# Altium project OK335xD.PrjPcb
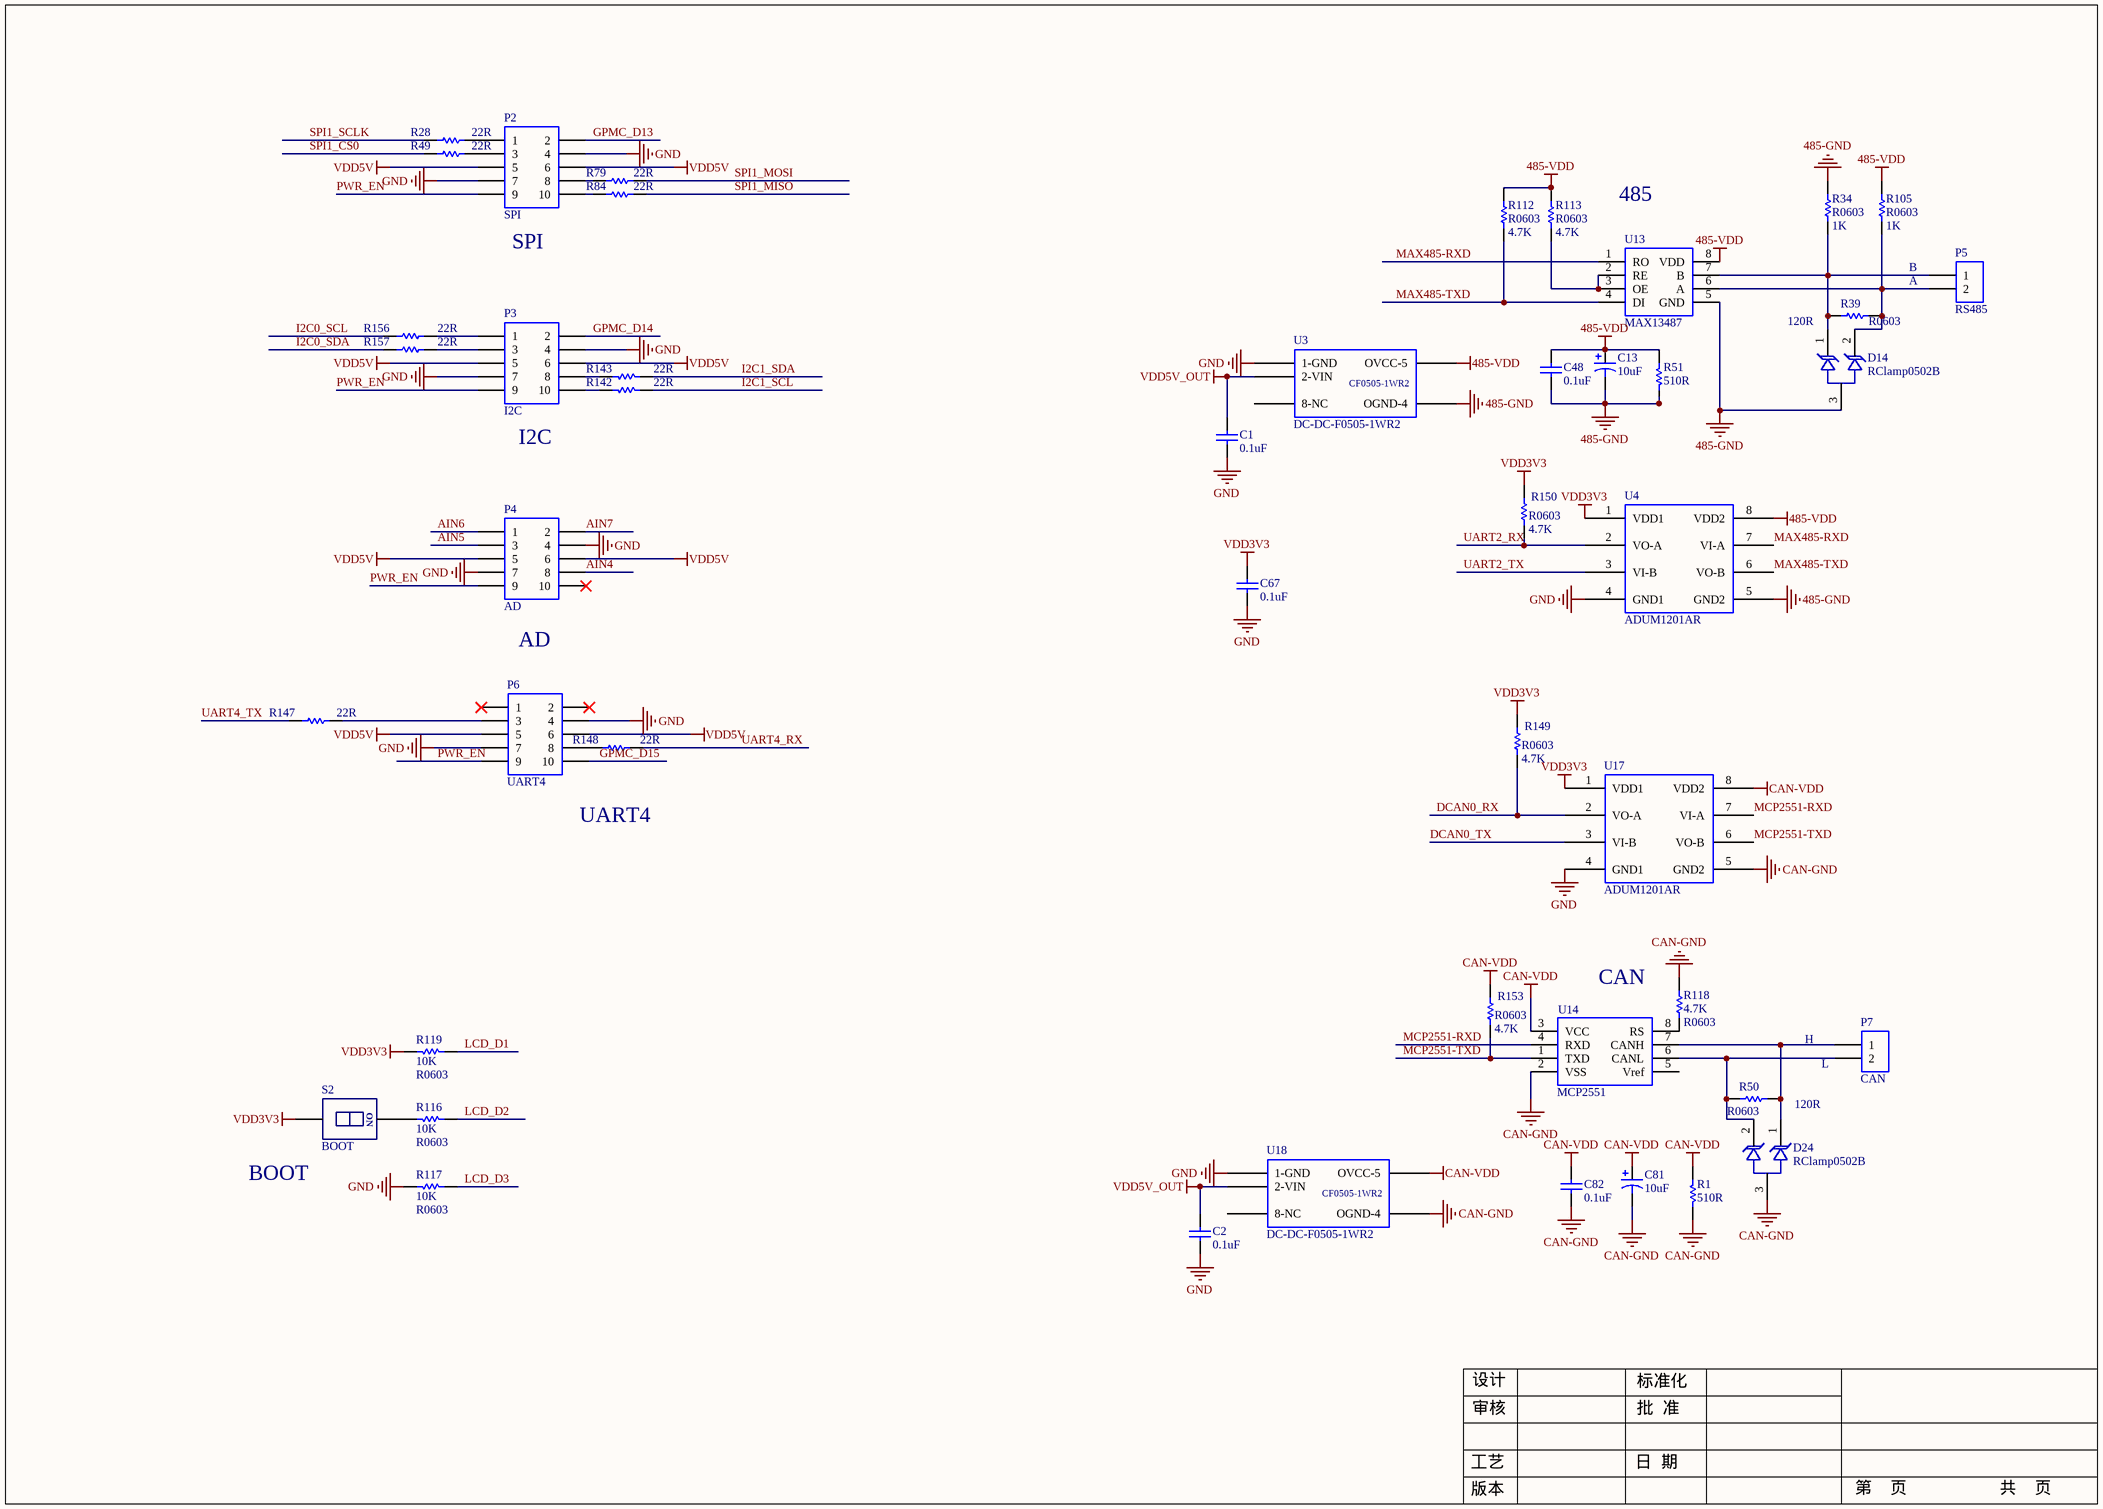
[diagram p0: AD & i2C & SPI.SchDoc]
8 sheets, 325 parts. Net scope: global (net labels, ports and power ports of the same name join across sheets).
Board file: OK335xD V2.4 20160121.PcbDoc
Sheets:
  AD & i2C & SPI.SchDoc
  Audio.SchDoc
  LCD.SchDoc
  NET & UART.SchDoc
  Power & SD.SchDoc
  SDIO_WIFI.SchDoc
  SODIMM.SchDoc
  USB.SchDoc

## Sheet AD & i2C & SPI.SchDoc
size 393 x 281 mm

### Parts
C1  value 0.1uF  [C0603_M1608]  (hidden comment: C0603)
C2  value 0.1uF  [C0603_M1608]  (hidden comment: C0603)
C13  value 10uF  [TC3216A]  (hidden comment: Cap Pol3)
C48  value 0.1uF  [C0603_M1608]  (hidden comment: C0603)
C67  value 0.1uF  [C0603_M1608]  (hidden comment: C0603)
C81  value 10uF  [TC3216A]  (hidden comment: Cap Pol3)
C82  value 0.1uF  [C0603_M1608]  (hidden comment: C0603)
D14  value RClamp0502B  [SOT-523]  (hidden comment: LCTVS)
D24  value RClamp0502B  [SOT-523]  (hidden comment: LCTVS)
P2  SPI  [IDC10S]
P3  I2C  [IDC10S]
P4  AD  [IDC10S]
P5  RS485  [2EDGKA-5.08-2P]
P6  UART4  [IDC10S]
P7  CAN  [2EDGKA-5.08-2P]
R1  value 510R  [1206]  (hidden comment: R1808)
R28  value 22R  [R0603_M1608]  (hidden comment: R0603)
R34  R0603  value 1K  [R0603_M1608]
R39  R0603  value 120R  [R0603_M1608]
R49  value 22R  [R0603_M1608]  (hidden comment: R0603)
R50  R0603  value 120R  [R0603_M1608]
R51  value 510R  [1206]  (hidden comment: R1808)
R79  value 22R  [R0603_M1608]  (hidden comment: R0603)
R84  value 22R  [R0603_M1608]  (hidden comment: R0603)
R105  R0603  value 1K  [R0603_M1608]
R112  R0603  value 4.7K  [R0603_M1608]
R113  R0603  value 4.7K  [R0603_M1608]
R116  10K  value R0603  [R0603_M1608]
R117  10K  value R0603  [R0603_M1608]
R118  4.7K  value R0603  [R0603_M1608]
R119  10K  value R0603  [R0603_M1608]
R142  value 22R  [R0603_M1608]  (hidden comment: R0603)
R143  value 22R  [R0603_M1608]  (hidden comment: R0603)
R147  value 22R  [R0603_M1608]  (hidden comment: R0603)
R148  value 22R  [R0603_M1608]  (hidden comment: R0603)
R149  R0603  value 4.7K  [R0603_M1608]
R150  R0603  value 4.7K  [R0603_M1608]
R153  R0603  value 4.7K  [R0603_M1608]
R156  value 22R  [R0603_M1608]  (hidden comment: R0603)
R157  value 22R  [R0603_M1608]  (hidden comment: R0603)
S2  BOOT  [SWITCH_1P]
U3  DC-DC-F0505-1WR2  [CF0505-1WR2]
U4  ADUM1201AR  [SO8_N - ADUM1201]
U13  MAX13487  [SOIC-8N]
U14  MCP2551  [SOIC-8N]
U17  ADUM1201AR  [SO8_N - ADUM1201]
U18  DC-DC-F0505-1WR2  [CF0505-1WR2]

### Nets
485-GND: C13.2 C48.1 D14.3 R34.1 R51.2 U3.4(OGND-4) U4.5(GND2) U13.5(GND)
485-VDD: C13.1 C48.2 R51.1 R105.1 R112.1 R113.1 U3.5(OVCC-5) U4.8(VDD2) U13.8(VDD)
CAN-GND: C81.2 C82.1 D24.3 R1.2 R118.1 U14.2(VSS) U17.5(GND2) U18.4(OGND-4)
CAN-VDD: C81.1 C82.2 R1.1 R153.1 U14.3(VCC) U17.8(VDD2) U18.5(OVCC-5)
GND: C1.1 C2.1 C67.1 P2.4 P2.7 P3.4 P3.7 P4.4 P4.7 P6.4 P6.7 R117.2 U3.1(1-GND) U4.4(GND1) U17.4(GND1) U18.1(1-GND)
VDD3V3: C67.2 R119.2 R149.1 R150.1 S2.1 U4.1(VDD1) U17.1(VDD1)
VDD5V: P2.5 P2.6 P3.5 P3.6 P4.5 P4.6 P6.5 P6.6
VDD5V_OUT: C1.2 C2.2 U3.2(2-VIN) U18.2(2-VIN)
AIN4: P4.8
AIN5: P4.3
AIN6: P4.1
AIN7: P4.2
DCAN0_RX: R149.2 U17.2(VO-A)
DCAN0_TX: U17.3(VI-B)
GPMC_D13: P2.2
GPMC_D14: P3.2
GPMC_D15: P6.10
I2C0_SCL: R156.2
I2C0_SDA: R157.2
I2C1_SCL: R142.1
I2C1_SDA: R143.1
LCD_D1: R119.1
LCD_D2: R116.1
LCD_D3: R117.1
MAX485-RXD: U4.7(VI-A) U13.1(RO)
MAX485-TXD: R112.2 U4.6(VO-B) U13.4(DI)
MCP2551-RXD: U14.4(RXD) U17.7(VI-A)
MCP2551-TXD: R153.2 U14.1(TXD) U17.6(VO-B)
PWR_EN: P2.9 P3.9 P4.9 P6.9
SPI1_CS0: R49.2
SPI1_MISO: R84.1
SPI1_MOSI: R79.1
SPI1_SCLK: R28.2
UART2_RX: R150.2 U4.2(VO-A)
UART2_TX: U4.3(VI-B)
UART4_RX: R148.2
UART4_TX: R147.1
NetD14_1: D14.1 P5.1 R34.2 R39.2 U13.7(B)
NetD14_2: D14.2 P5.2 R39.1 R105.2 U13.6(A)
NetD24_1: D24.1 P7.1 R50.1 U14.7(CANH)
NetD24_2: D24.2 P7.2 R50.2 U14.6(CANL)
NetP2_1: P2.1 R28.1
NetP2_3: P2.3 R49.1
NetP2_8: P2.8 R79.2
NetP2_10: P2.10 R84.2
NetP3_1: P3.1 R156.1
NetP3_3: P3.3 R157.1
NetP3_8: P3.8 R143.2
NetP3_10: P3.10 R142.2
NetP6_3: P6.3 R147.2
NetP6_8: P6.8 R148.1
NetR113_2: R113.2 U13.2(RE) U13.3(OE)
NetR116_2: R116.2 S2.2
NetR118_2: R118.2 U14.8(RS)

Not connected (* = marked no-connect by the designer): P4 10*; P6 1* 2*; U3 8(8-NC); U14 5(Vref); U18 8(8-NC)

### Notes on the sheet
- 485
- (near P2) SPI
- A
- B
- (near P3) I2C
- AD
- UART4
- CAN
- (near P7) H
- L
- (near S2) BOOT
- 设计
- 标准化
- 审核
- 批  准
- 版本
- 工艺
- 日  期
- 第    页
- 共    页
- (in symbol DC-DC-F0505-1WR2) CF0505-1WR2
- (in symbol SW DIP-1) ON

### Library data of the parts
C1 C2 C48 C67 C82 = Cap: Capacitor; Published: 8-Jun-2000; LatestRevisionDate: 17-Jul-2002; LatestRevisionNote: Re-released for DXP Platform.; PackageReference: RAD-0.3; Publisher: Altium Limited
C13 C81 = Cap Pol3: Polarized Capacitor (Surface Mount); Published: 8-Jun-2000; LatestRevisionDate: 29-May-2009; LatestRevisionNote: IPC-7351 Footprint Added.; PackageReference: C0805; Publisher: Altium Limited; PackageDescription: Chip Capacitor
P2-P4 P6 = Header 5X2: Header, 5-Pin, Dual row; LatestRevisionDate: 17-Jul-2002; LatestRevisionNote: Re-released for DXP Platform.; Publisher: Altium Limited
P5 P7 = Header 2: Header, 2-Pin; LatestRevisionDate: 17-Jul-2002; LatestRevisionNote: Re-released for DXP Platform.; Publisher: Altium Limited
R1 R28 R34 R39 R49-R51 R79 R84 R105 R112 R113 R142 R143 R147-R150 R153 R156 R157 = Res1: Resistor; Published: 8-Jun-2000; LatestRevisionDate: 17-Jul-2002; LatestRevisionNote: Re-released for DXP Platform.; PackageReference: AXIAL-0.3; Publisher: Altium Limited
R116-R119 = Res1: R0603; Published: 8-Jun-2000; LatestRevisionDate: 17-Jul-2002; LatestRevisionNote: Re-released for DXP Platform.; PackageReference: AXIAL-0.3; Publisher: Altium Limited; PackageDescription: Axial Device, Thru-Hole; 2 Leads; 0.3 in Pin Spacing
S2 = SW DIP-1
U4 U17 = ADuM1201
U13 = MAX485: SOIC8
U14 = MCP2551: SOIC8

## Sheet Audio.SchDoc
size 393 x 281 mm
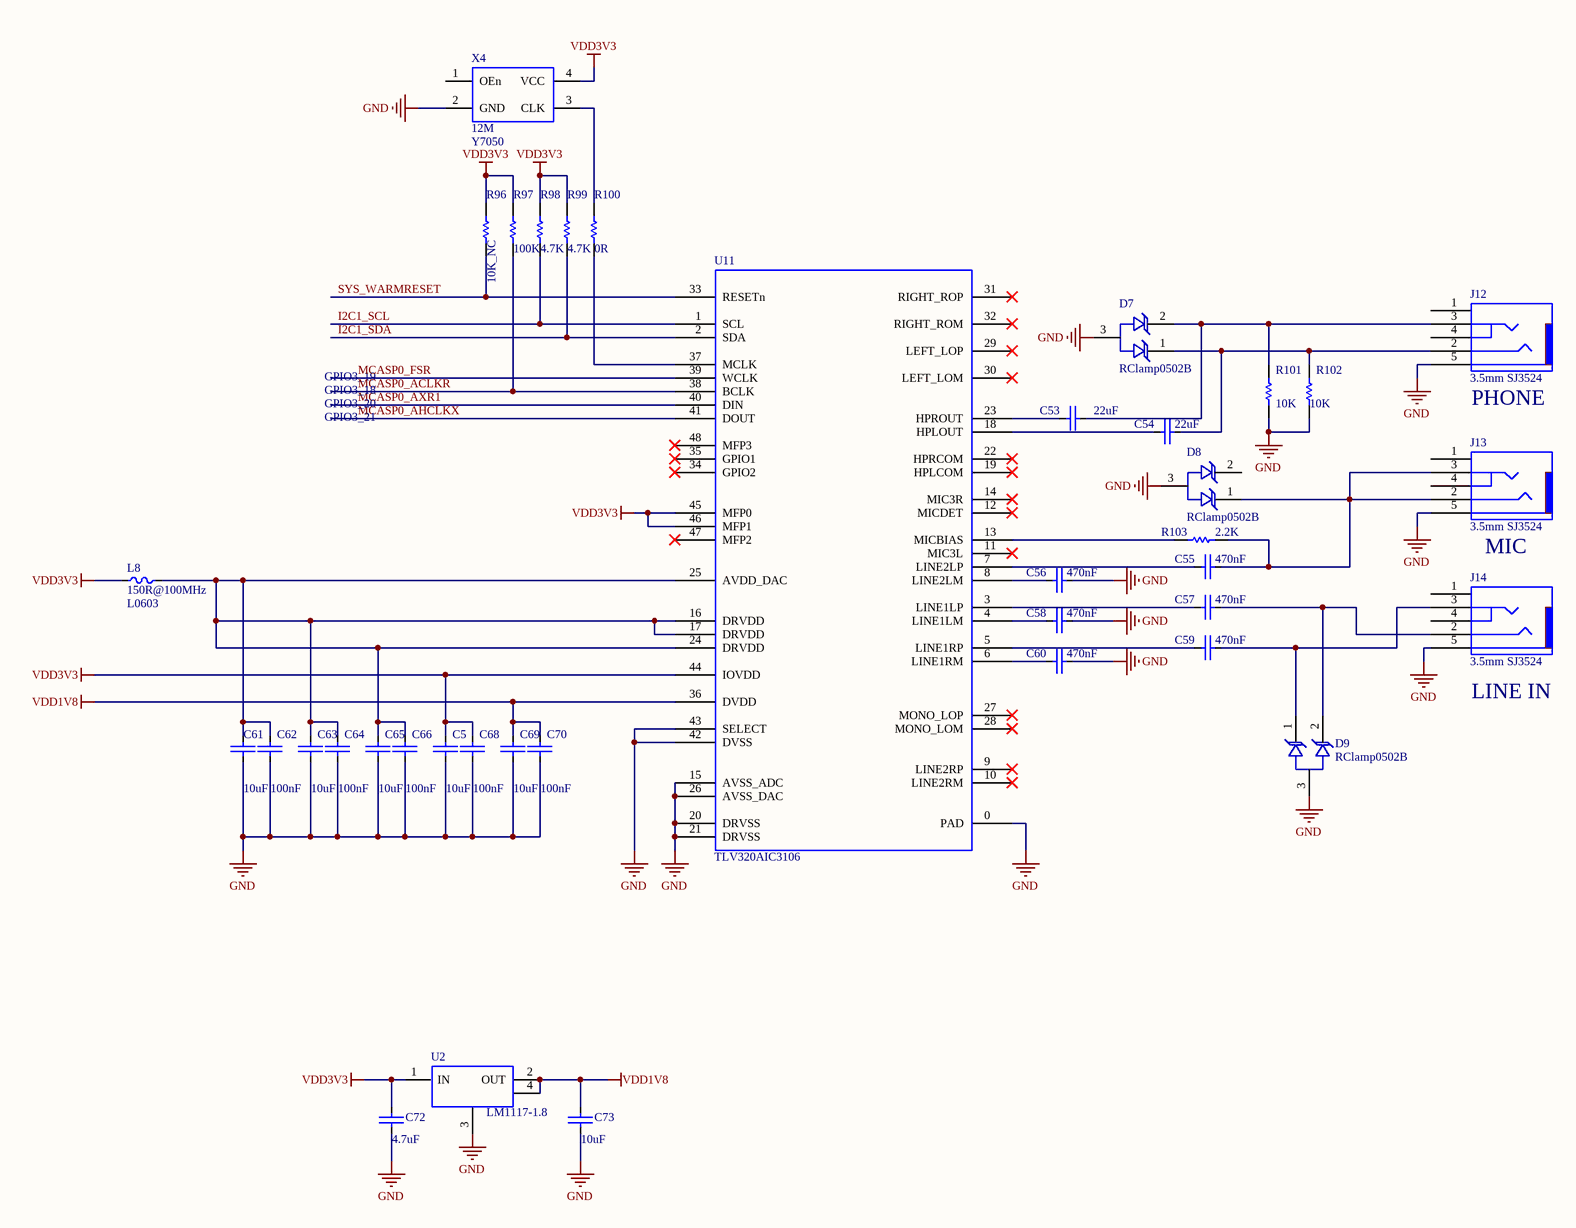
[diagram p1: Audio.SchDoc]

### Parts
C5  10uF  [C0603_M1608]
C53  22uF  [C1210_M3225]
C54  22uF  [C1210_M3225]
C55  470nF  [C0603_M1608]
C56  470nF  [C0603_M1608]
C57  470nF  [C0603_M1608]
C58  470nF  [C0603_M1608]
C59  470nF  [C0603_M1608]
C60  470nF  [C0603_M1608]
C61  10uF  [C0603_M1608]
C62  100nF  [C0603_M1608]
C63  10uF  [C0603_M1608]
C64  100nF  [C0603_M1608]
C65  10uF  [C0603_M1608]
C66  100nF  [C0603_M1608]
C68  100nF  [C0603_M1608]
C69  10uF  [C0603_M1608]
C70  100nF  [C0603_M1608]
C72  4.7uF  [C0603_M1608]
C73  10uF  [C0603_M1608]
D7  value RClamp0502B  [SOT-523]  (hidden comment: LCTVS)
D8  value RClamp0502B  [SOT-523]  (hidden comment: LCTVS)
D9  value RClamp0502B  [SOT-523]  (hidden comment: LCTVS)
J12  3.5mm SJ3524  [3.5mm SJ3524]
J13  3.5mm SJ3524  [3.5mm SJ3524]
J14  3.5mm SJ3524  [3.5mm SJ3524]
L8  150R@100MHz  value L0603  [L0603_M1608]
R96  10K_NC  [R0603_M1608]
R97  100K  [R0603_M1608]
R98  4.7K  [R0603_M1608]
R99  4.7K  [R0603_M1608]
R100  0R  [R0603_M1608]
R101  10K  [R0603_M1608]
R102  10K  [R0603_M1608]
R103  2.2K  [R0603_M1608]
U2  value LM1117-1.8  [LM1117]  (hidden comment: LM1117)
U11  TLV320AIC3106  [QFN48(TLV320)]
X4  12M  value Y7050  [Y7050]

### Nets
GND: C5.2 C56.2 C58.2 C60.2 C61.2 C62.2 C63.2 C64.2 C65.2 C66.2 C68.2 C69.2 C70.2 C72.2 C73.2 D7.3 D8.3 D9.3 J12.5 J13.5 J14.5 R101.1 R102.1 U2.3(GND) U11.0(PAD) U11.15(AVSS_ADC) U11.20(DRVSS) U11.21(DRVSS) U11.26(AVSS_DAC) U11.42(DVSS) U11.43(SELECT) X4.2(GND)
VDD1V8: C69.1 C70.1 C73.1 U2.2(OUT) U2.4 U11.36(DVDD)
VDD3V3: C5.1 C68.1 C72.1 L8.2 R96.2 R97.2 R98.2 R99.2 U2.1(IN) U11.44(IOVDD) U11.45(MFP0) U11.46(MFP1) X4.4(VCC)
I2C1_SCL: R98.1 U11.1(SCL)
I2C1_SDA: R99.1 U11.2(SDA)
MCASP0_ACLKR: R97.1 U11.38(BCLK)
MCASP0_AHCLKX: U11.41(DOUT)
MCASP0_AXR1: U11.40(DIN)
MCASP0_FSR: U11.39(WCLK)
SYS_WARMRESET: R96.1 U11.33(RESETn)
NetC53_1: C53.1 U11.23(HPROUT)
NetC53_2: C53.2 D7.2 J12.3 R101.2
NetC54_1: C54.1 U11.18(HPLOUT)
NetC54_2: C54.2 D7.1 J12.2 R102.2
NetC55_1: C55.1 U11.7(LINE2LP)
NetC55_2: C55.2 D8.1 J13.2 J13.3 R103.1
NetC56_1: C56.1 U11.8(LINE2LM)
NetC57_1: C57.1 U11.3(LINE1LP)
NetC57_2: C57.2 D9.2 J14.2
NetC58_1: C58.1 U11.4(LINE1LM)
NetC59_1: C59.1 U11.5(LINE1RP)
NetC59_2: C59.2 D9.1 J14.3
NetC60_1: C60.1 U11.6(LINE1RM)
NetC61_1: C61.1 C62.1 C63.1 C64.1 C65.1 C66.1 L8.1 U11.16(DRVDD) U11.17(DRVDD) U11.24(DRVDD) U11.25(AVDD_DAC)
NetR100_1: R100.1 U11.37(MCLK)
NetR100_2: R100.2 X4.3(CLK)
NetR103_2: R103.2 U11.13(MICBIAS)

Not connected (* = marked no-connect by the designer): D8 2; J12 1 4; J13 1 4; J14 1 4; U11 9(LINE2RP)* 10(LINE2RM)* 11(MIC3L)* 12(MICDET)* 14(MIC3R)* 19(HPLCOM)* 22(HPRCOM)* 27(MONO_LOP)* 28(MONO_LOM)* 29(LEFT_LOP)* 30(LEFT_LOM)* 31(RIGHT_ROP)* 32(RIGHT_ROM)* 34(GPIO2)* 35(GPIO1)* 47(MFP2)* 48(MFP3)*; X4 1(OEn)

### Notes on the sheet
- GPIO3_21
- GPIO3_20
- GPIO3_19
- GPIO3_18
- (near J12) PHONE
- MIC
- (near J14) LINE IN
- 设计
- 标准化
- 审核
- 批  准
- 版本
- 工艺
- 日  期
- 第    页
- 共    页

### Library data of the parts
C5 C53-C66 C68-C70 C72 C73 = CAP_1: value: C0805
L8 = BEADS: 0603
R96-R103 = Res1: R0603; Published: 8-Jun-2000; LatestRevisionDate: 17-Jul-2002; LatestRevisionNote: Re-released for DXP Platform.; PackageReference: AXIAL-0.3; Publisher: Altium Limited; PackageDescription: Axial Device, Thru-Hole; 2 Leads; 0.3 in Pin Spacing; Value: R0603
U11 = TLV320AIC3106: AUDIO ENCODE
X4 = 12M XTAL

## Sheet LCD.SchDoc
size 292 x 279 mm
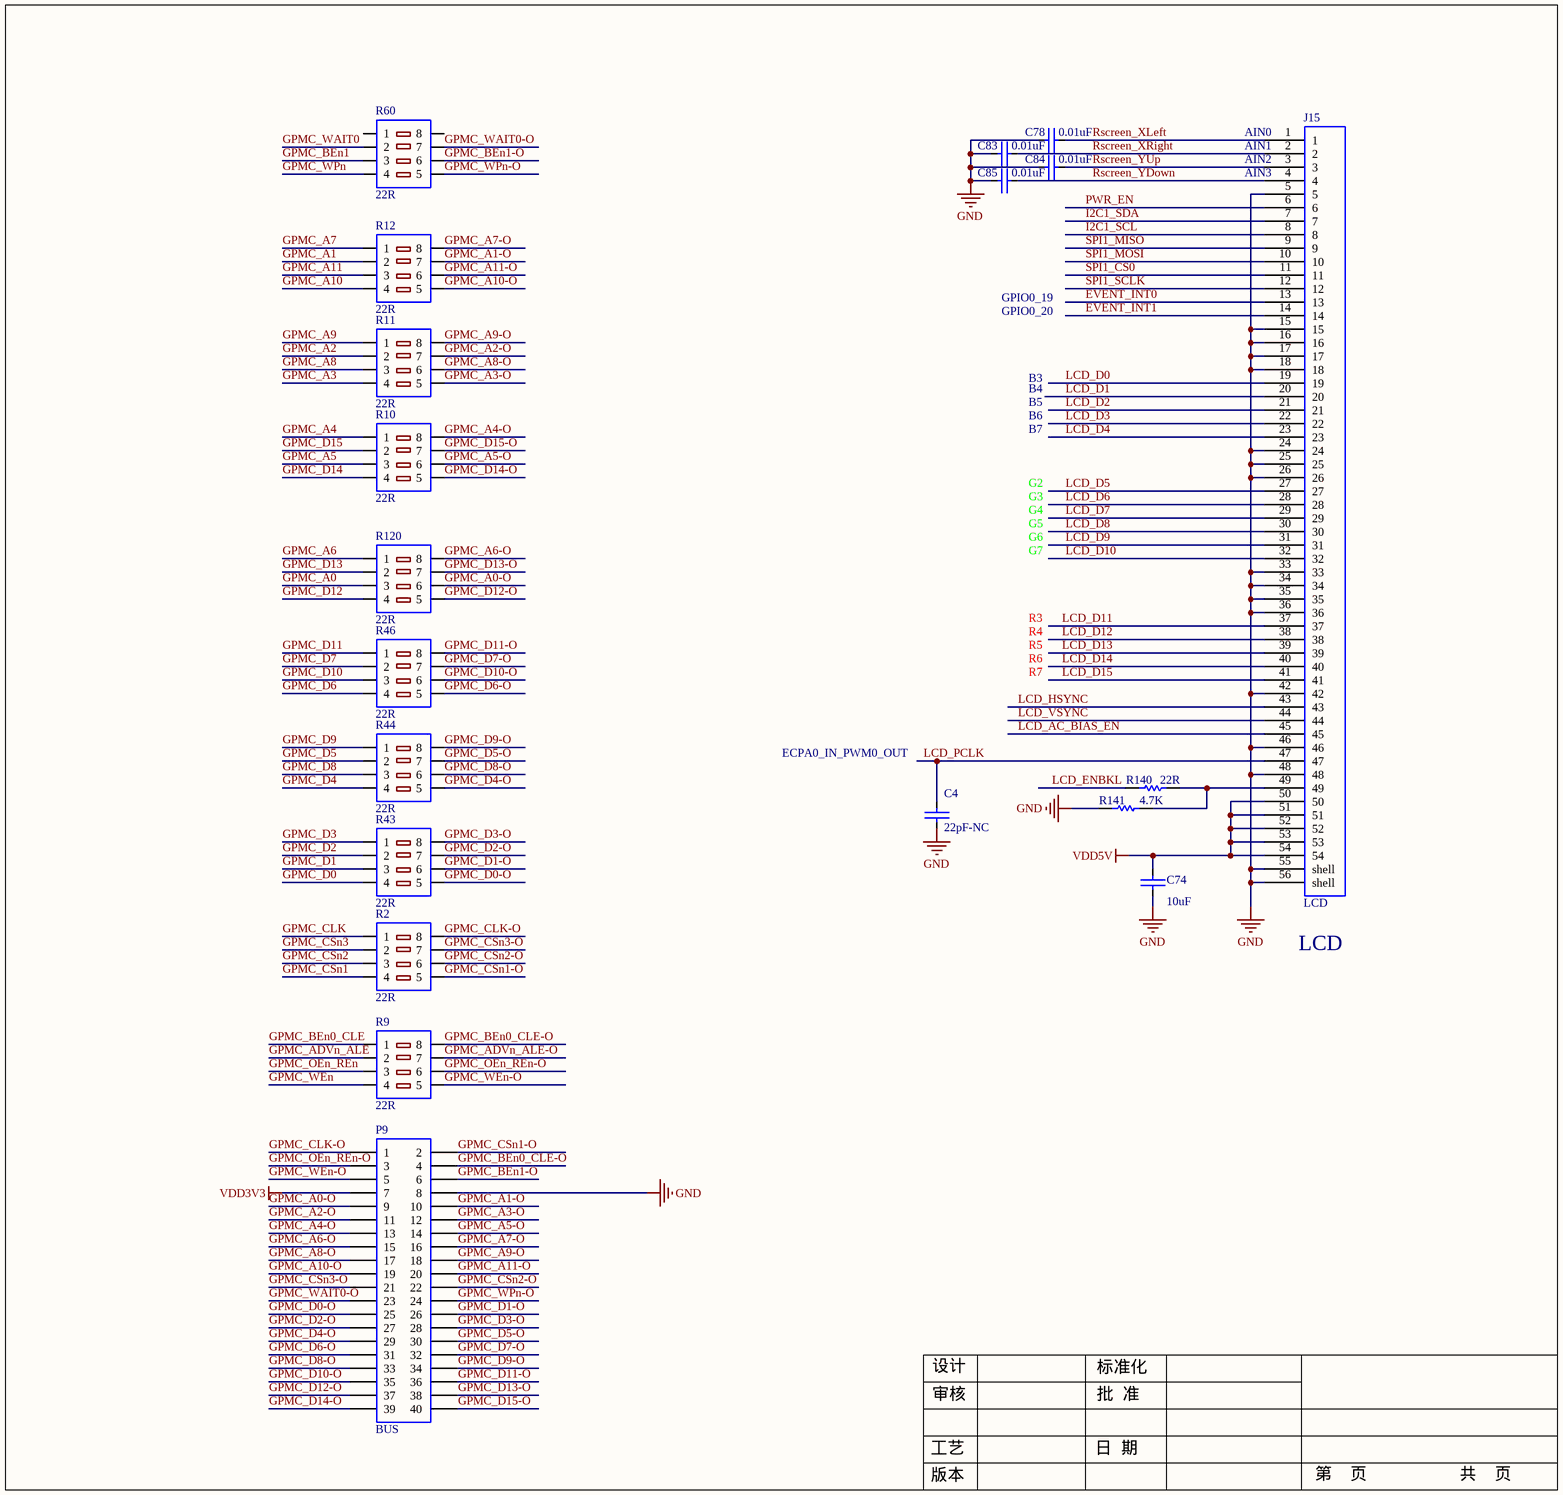
[diagram p2: LCD.SchDoc]

### Parts
C4  22pF-NC  [C0603_M1608]
C74  10uF  [C0603_M1608]
C78  0.01uF  [C0603_M1608]
C83  0.01uF  [C0603_M1608]
C84  0.01uF  [C0603_M1608]
C85  0.01uF  [C0603_M1608]
J15  LCD  [FPC54]
P9  BUS  [IDC40S]
R2  22R  [R0603-8P4R]
R9  22R  [R0603-8P4R]
R10  22R  [R0603-8P4R]
R11  22R  [R0603-8P4R]
R12  22R  [R0603-8P4R]
R43  22R  [R0603-8P4R]
R44  22R  [R0603-8P4R]
R46  22R  [R0603-8P4R]
R60  22R  [R0603-8P4R]
R120  22R  [R0603-8P4R]
R140  22R  [R0603_M1608]
R141  4.7K  [R0603_M1608]

### Nets
GND: C4.1 C74.2 C78.2 C83.2 C84.2 C85.2 J15.5 J15.15 J15.16 J15.17 J15.18 J15.24 J15.25 J15.26 J15.33 J15.34 J15.35 J15.36 J15.42 J15.46 J15.48 J15.55(shell) J15.56(shell) P9.8 R141.1
VDD3V3: P9.7
VDD5V: C74.1 J15.50 J15.51 J15.52 J15.53 J15.54
EVENT_INT0: J15.13
EVENT_INT1: J15.14
GPMC_A0: R120.3  [project net GPIO1_16]
GPMC_A0-O: P9.9 R120.6
GPMC_A1: R12.2  [project net GPIO1_17]
GPMC_A1-O: P9.10 R12.7
GPMC_A2: R11.2  [project net GPIO1_18]
GPMC_A2-O: P9.11 R11.7
GPMC_A3: R11.4  [project net GPIO1_19]
GPMC_A3-O: P9.12 R11.5
GPMC_A4: R10.1  [project net GPIO1_20]
GPMC_A4-O: P9.13 R10.8
GPMC_A5: R10.3  [project net GPIO1_21]
GPMC_A5-O: P9.14 R10.6
GPMC_A6: R120.1  [project net GPIO1_22]
GPMC_A6-O: P9.15 R120.8
GPMC_A7: R12.1  [project net GPIO1_23]
GPMC_A7-O: P9.16 R12.8
GPMC_A8: R11.3  [project net GPIO1_24]
GPMC_A8-O: P9.17 R11.6
GPMC_A9: R11.1  [project net GPIO1_25]
GPMC_A9-O: P9.18 R11.8
GPMC_A10: R12.4
GPMC_A10-O: P9.19 R12.5
GPMC_A11: R12.3
GPMC_A11-O: P9.20 R12.6
GPMC_ADVn_ALE: R9.2
GPMC_ADVn_ALE-O: R9.7
GPMC_BEn0_CLE: R9.1
GPMC_BEn0_CLE-O: P9.4 R9.8
GPMC_BEn1: R60.3
GPMC_BEn1-O: P9.6 R60.6
GPMC_CLK: R2.1  [project net GPIO2_1]
GPMC_CLK-O: P9.1 R2.8
GPMC_CSn1: R2.4
GPMC_CSn1-O: P9.2 R2.5
GPMC_CSn2: R2.3
GPMC_CSn2-O: P9.22 R2.6
GPMC_CSn3: R2.2
GPMC_CSn3-O: P9.21 R2.7
GPMC_D0: R43.4
GPMC_D0-O: P9.25 R43.5
GPMC_D1: R43.3
GPMC_D1-O: P9.26 R43.6
GPMC_D2: R43.2
GPMC_D2-O: P9.27 R43.7
GPMC_D3: R43.1
GPMC_D3-O: P9.28 R43.8
GPMC_D4: R44.4
GPMC_D4-O: P9.29 R44.5
GPMC_D5: R44.2
GPMC_D5-O: P9.30 R44.7
GPMC_D6: R46.4
GPMC_D6-O: P9.31 R46.5
GPMC_D7: R46.2
GPMC_D7-O: P9.32 R46.7
GPMC_D8: R44.3
GPMC_D8-O: P9.33 R44.6
GPMC_D9: R44.1
GPMC_D9-O: P9.34 R44.8
GPMC_D10: R46.3
GPMC_D10-O: P9.35 R46.6
GPMC_D11: R46.1
GPMC_D11-O: P9.36 R46.8
GPMC_D12: R120.4
GPMC_D12-O: P9.37 R120.5
GPMC_D13: R120.2
GPMC_D13-O: P9.38 R120.7
GPMC_D14: R10.4
GPMC_D14-O: P9.39 R10.5
GPMC_D15: R10.2
GPMC_D15-O: P9.40 R10.7
GPMC_OEn_REn: R9.3
GPMC_OEn_REn-O: P9.3 R9.6
GPMC_WAIT0: R60.2
GPMC_WAIT0-O: P9.23 R60.7
GPMC_WEn: R9.4
GPMC_WEn-O: P9.5 R9.5
GPMC_WPn: R60.4
GPMC_WPn-O: P9.24 R60.5
I2C1_SCL: J15.8
I2C1_SDA: J15.7
LCD_AC_BIAS_EN: J15.45
LCD_D0: J15.19
LCD_D1: J15.20
LCD_D2: J15.21
LCD_D3: J15.22
LCD_D4: J15.23
LCD_D5: J15.27
LCD_D6: J15.28
LCD_D7: J15.29
LCD_D8: J15.30
LCD_D9: J15.31
LCD_D10: J15.32
LCD_D11: J15.37
LCD_D12: J15.38
LCD_D13: J15.39
LCD_D14: J15.40
LCD_D15: J15.41
LCD_ENBKL: R140.1
LCD_HSYNC: J15.43
LCD_PCLK: C4.2 J15.47
LCD_VSYNC: J15.44
PWR_EN: J15.6
Rscreen_XLeft: C78.1 J15.1
Rscreen_XRight: C83.1 J15.2
Rscreen_YDown: C85.1 J15.4
Rscreen_YUp: C84.1 J15.3
SPI1_CS0: J15.11
SPI1_MISO: J15.9
SPI1_MOSI: J15.10
SPI1_SCLK: J15.12
NetJ15_49: J15.49 R140.2 R141.2

Not connected (* = marked no-connect by the designer): R60 1 8

### Notes on the sheet
- (near J15) AIN2
- (near J15) AIN1
- (near J15) AIN0
- (near J15) AIN3
- GPIO0_19
- GPIO0_20
- B3
- B4
- B5
- B7
- B6
- G2
- G3
- G4
- G5
- G7
- G6
- R3
- R4
- R5
- R7
- R6
- ECPA0_IN_PWM0_OUT
- (near J15) LCD
- 设计
- 标准化
- 审核
- 批  准
- 版本
- 工艺
- 日  期
- 第    页
- 共    页

### Library data of the parts
C4 C74 C78 C83-C85 = CAP_1: value: C0805
J15 = FPC54
P9 = Header 20X2: Header, 20-Pin, Dual row; LatestRevisionDate: 17-Jul-2002; LatestRevisionNote: Re-released for DXP Platform.; Publisher: Altium Limited
R2 R9-R12 R43 R44 R46 R60 R120 = 8P4R
R140 R141 = Res1: R0603; Published: 8-Jun-2000; LatestRevisionDate: 17-Jul-2002; LatestRevisionNote: Re-released for DXP Platform.; PackageReference: AXIAL-0.3; Publisher: Altium Limited; PackageDescription: Axial Device, Thru-Hole; 2 Leads; 0.3 in Pin Spacing; Value: R0603

## Sheet NET & UART.SchDoc
size 393 x 281 mm
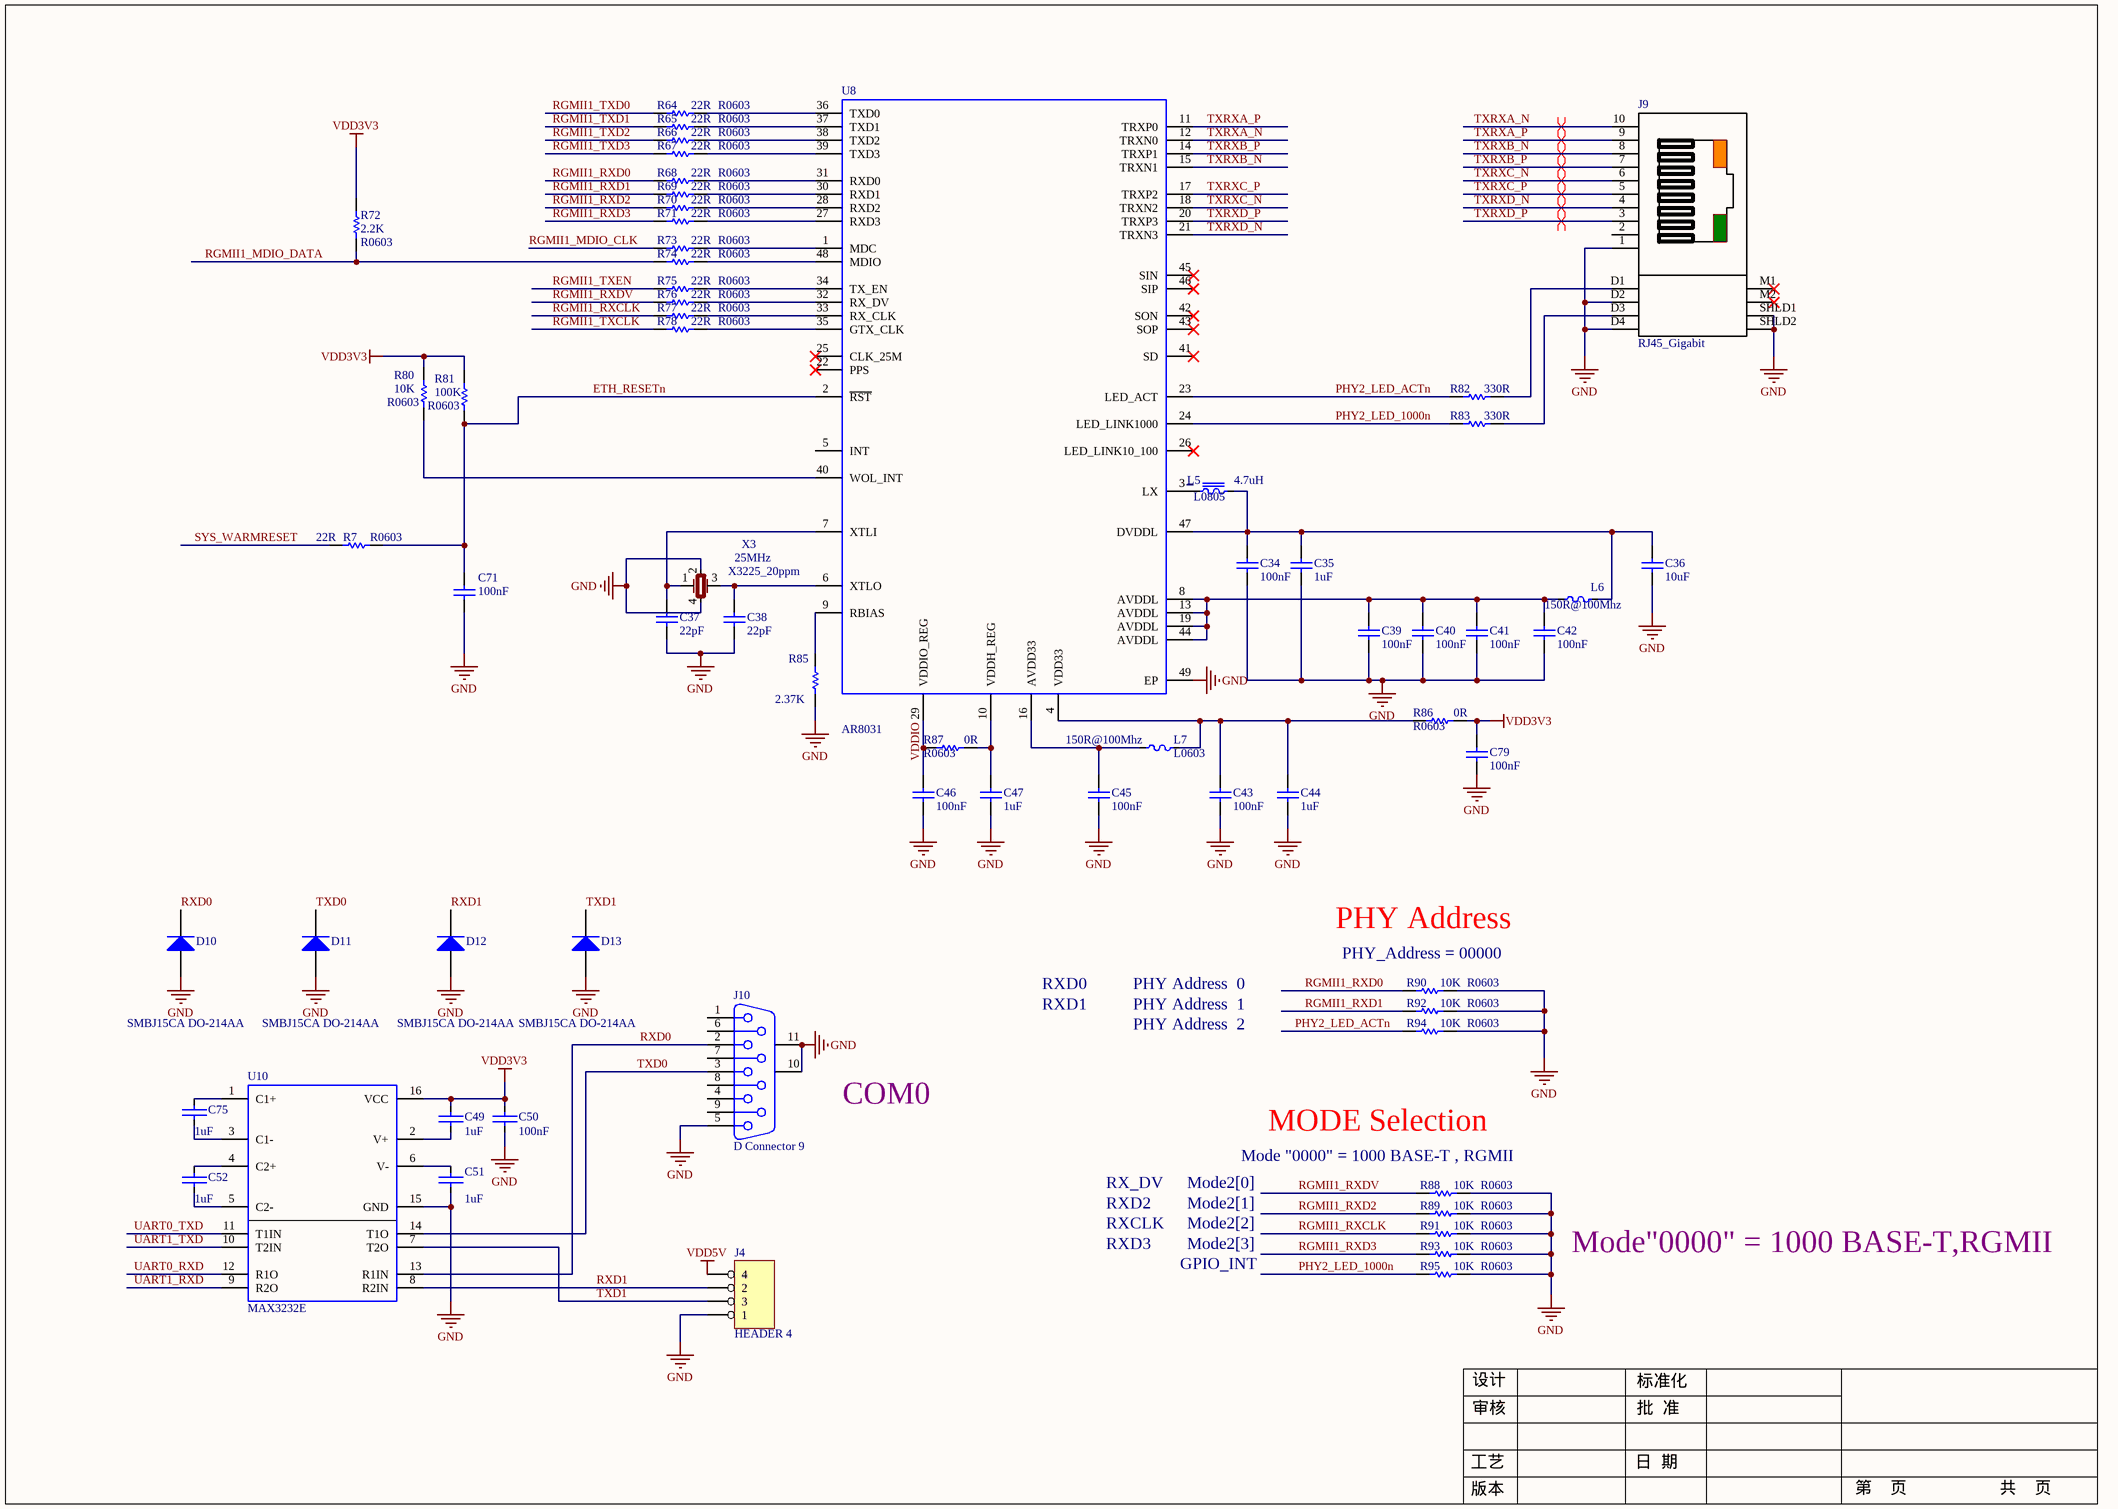
[diagram p3: NET & UART.SchDoc]

### Parts
(Parts that share a designator on the sheet are numbered #1, #2 ... from top to bottom, then left to right.)
C34  value 100nF  [C0603_M1608]  (hidden comment: C0603)
C35  value 1uF  [C0603_M1608]  (hidden comment: C0603)
C36  value 10uF  [C0603_M1608]  (hidden comment: C0603)
C37  value 22pF  [C0603_M1608]  (hidden comment: C0603)
C38  value 22pF  [C0603_M1608]  (hidden comment: C0603)
C39  value 100nF  [C0603_M1608]  (hidden comment: C0603)
C40  value 100nF  [C0603_M1608]  (hidden comment: C0603)
C41  value 100nF  [C0603_M1608]  (hidden comment: C0603)
C42  value 100nF  [C0603_M1608]  (hidden comment: C0603)
C43  value 100nF  [C0603_M1608]  (hidden comment: C0603)
C44  value 1uF  [C0603_M1608]  (hidden comment: C0603)
C45  value 100nF  [C0603_M1608]  (hidden comment: C0603)
C46  value 100nF  [C0603_M1608]  (hidden comment: C0603)
C47  value 1uF  [C0603_M1608]  (hidden comment: C0603)
C49  1uF  [C0603_M1608]
C50  100nF  [C0603_M1608]
C51  1uF  [C0603_M1608]
C52  1uF  [C0603_M1608]
C71  value 100nF  [C0603_M1608]  (hidden comment: C0603)
C75  1uF  [C0603_M1608]
C79  value 100nF  [C0603_M1608]  (hidden comment: C0603)
D10  SMBJ15CA DO-214AA  [DIODE-SK34A]
D11  SMBJ15CA DO-214AA  [DIODE-SK34A]
D12  SMBJ15CA DO-214AA  [DIODE-SK34A]
D13  SMBJ15CA DO-214AA  [DIODE-SK34A]
J4#1  HEADER 4  [KF2EDG-4P-3.81mm]
J9  RJ45_Gigabit  [RG45_Gagabit]
J10  D Connector 9  [DB9/M]
L5  4.7uH  value L0805  [L0805]
L6  150R@100Mhz  [L0603_M1608]
L7  150R@100Mhz  value L0603  [L0603_M1608]
R7  R0603  value 22R  [R0603_M1608]
R64  22R  value R0603  [R0603_M1608]
R65  22R  value R0603  [R0603_M1608]
R66  22R  value R0603  [R0603_M1608]
R67  22R  value R0603  [R0603_M1608]
R68  22R  value R0603  [R0603_M1608]
R69  22R  value R0603  [R0603_M1608]
R70  22R  value R0603  [R0603_M1608]
R71  22R  value R0603  [R0603_M1608]
R72  2.2K  value R0603  [R0603_M1608]
R73  22R  value R0603  [R0603_M1608]
R74  22R  value R0603  [R0603_M1608]
R75  22R  value R0603  [R0603_M1608]
R76  22R  value R0603  [R0603_M1608]
R77  22R  value R0603  [R0603_M1608]
R78  22R  value R0603  [R0603_M1608]
R80  10K  value R0603  [R0603_M1608]
R81  100K  value R0603  [R0603_M1608]
R82  330R  [R0603_M1608]
R83  330R  [R0603_M1608]
R85  2.37K  [R0603_M1608]
R86  0R  value R0603  [R0603_M1608]
R87  0R  value R0603  [R0603_M1608]
R88  10K  value R0603  [R0603_M1608]
R89  10K  value R0603  [R0603_M1608]
R90  10K  value R0603  [R0603_M1608]
R91  10K  value R0603  [R0603_M1608]
R92  10K  value R0603  [R0603_M1608]
R93  10K  value R0603  [R0603_M1608]
R94  10K  value R0603  [R0603_M1608]
R95  10K  value R0603  [R0603_M1608]
U8  AR8031  [QFN48C40P600X600_AR8031]
U10  MAX3232E  [SOIC-16N]
X3  25MHz  value X3225_20ppm  [Crystals_3225]

### Nets
GND: C34.1 C35.1 C36.1 C37.1 C38.1 C39.1 C40.1 C41.1 C42.1 C43.1 C44.1 C45.1 C46.1 C47.1 C50.2 C51.2 C71.1 C79.1 D10.1(A) D11.1(A) D12.1(A) D13.1(A) J4#1.1 J9.1 J9.D2 J9.D4 J9.SHLD1 J9.SHLD2 J10.5 J10.10(MH1) J10.11(MH2) R85.2 R88.1 R89.1 R90.1 R91.1 R92.1 R93.1 R94.1 R95.1 U8.49(EP) U10.15(GND) X3.2 X3.4
VDD3V3: C49.1 C50.1 C79.2 R72.1 R80.2 R81.2 R86.2 U10.16(VCC)
VDD5V: J4#1.4
ETH_RESETn: C71.2 R7.1 R81.1 U8.2(~{RST})
PHY2_LED_1000n: R83.1 R95.2 U8.24(LED_LINK1000)
PHY2_LED_ACTn: R82.1 R94.2 U8.23(LED_ACT)
RGMII1_MDIO_CLK: R73.2
RGMII1_MDIO_DATA: R72.2 R74.2
RGMII1_RXCLK: R77.2 R91.2
RGMII1_RXD0: R68.2 R90.2
RGMII1_RXD1: R69.2 R92.2
RGMII1_RXD2: R70.2 R89.2
RGMII1_RXD3: R71.2 R93.2
RGMII1_RXDV: R76.2 R88.2
RGMII1_TXCLK: R78.2
RGMII1_TXD0: R64.2
RGMII1_TXD1: R65.2
RGMII1_TXD2: R66.2
RGMII1_TXD3: R67.2
RGMII1_TXEN: R75.2
RXD0: D10.2(K) J10.2 U10.13(R1IN)
RXD1: D12.2(K) J4#1.2 U10.8(R2IN)
SYS_WARMRESET: R7.2
TXD0: D11.2(K) J10.3 U10.14(T1O)
TXD1: D13.2(K) J4#1.3 U10.7(T2O)
TXRXA_N: J9.10 U8.12(TRXN0)
TXRXA_P: J9.9 U8.11(TRXP0)
TXRXB_N: J9.8 U8.15(TRXN1)
TXRXB_P: J9.7 U8.14(TRXP1)
TXRXC_N: J9.6 U8.18(TRXN2)
TXRXC_P: J9.5 U8.17(TRXP2)
TXRXD_N: J9.4 U8.21(TRXN3)
TXRXD_P: J9.3 U8.20(TRXP3)
UART0_RXD: U10.12(R1O)
UART0_TXD: U10.11(T1IN)
UART1_RXD: U10.9(R2O)
UART1_TXD: U10.10(T2IN)
VDDIO: C46.2 R87.1 U8.29(VDDIO_REG)
NetC34_2: C34.2 C35.2 C36.2 L5.2 L6.1 U8.47(DVDDL)
NetC37_2: C37.2 U8.7(XTLI) X3.1
NetC38_2: C38.2 U8.6(XTLO) X3.3
NetC39_2: C39.2 C40.2 C41.2 C42.2 L6.2 U8.8(AVDDL) U8.13(AVDDL) U8.19(AVDDL) U8.44(AVDDL)
NetC43_2: C43.2 C44.2 L7.2 R86.1 U8.4(VDD33)
NetC45_2: C45.2 L7.1 U8.16(AVDD33)
NetC47_2: C47.2 R87.2 U8.10(VDDH_REG)
NetC49_2: C49.2 U10.2(V+)
NetC51_1: C51.1 U10.6(V-)
NetC52_1: C52.1 U10.4(C2+)
NetC52_2: C52.2 U10.5(C2-)
NetC75_1: C75.1 U10.1(C1+)
NetC75_2: C75.2 U10.3(C1-)
NetJ9_D1: J9.D1 R82.2
NetJ9_D3: J9.D3 R83.2
NetL5_1: L5.1 U8.3(LX)
NetR64_1: R64.1 U8.36(TXD0)
NetR65_1: R65.1 U8.37(TXD1)
NetR66_1: R66.1 U8.38(TXD2)
NetR67_1: R67.1 U8.39(TXD3)
NetR68_1: R68.1 U8.31(RXD0)
NetR69_1: R69.1 U8.30(RXD1)
NetR70_1: R70.1 U8.28(RXD2)
NetR71_1: R71.1 U8.27(RXD3)
NetR73_1: R73.1 U8.1(MDC)
NetR74_1: R74.1 U8.48(MDIO)
NetR75_1: R75.1 U8.34(TX_EN)
NetR76_1: R76.1 U8.32(RX_DV)
NetR77_1: R77.1 U8.33(RX_CLK)
NetR78_1: R78.1 U8.35(GTX_CLK)
NetR80_1: R80.1 U8.40(WOL_INT)
NetR85_1: R85.1 U8.9(RBIAS)

Not connected (* = marked no-connect by the designer): J9 2 M1* M2*; J10 1 4 6 7 8 9; U8 5(INT) 22(PPS)* 25(CLK_25M)* 26(LED_LINK10_100)* 41(SD)* 42(SON)* 43(SOP)* 45(SIN)* 46(SIP)*

### Layout directives
differential pair: TXRXA_N, TXRXA_P, TXRXB_N, TXRXB_P, TXRXC_N, TXRXC_P, TXRXD_N, TXRXD_P

### Notes on the sheet
- RXD0
- PHY Address  0
- PHY Address
- (near R90) PHY_Address = 00000
- RXD1
- PHY Address  1
- PHY Address  2
- COM0
- RX_DV
- Mode2[0]
- (near R88) Mode "0000" = 1000 BASE-T , RGMII
- MODE Selection
- RXD3
- RXD2
- RXCLK
- Mode2[1]
- Mode2[2]
- Mode2[3]
- Mode"0000" = 1000 BASE-T,RGMII
- GPIO_INT
- 设计
- 标准化
- 审核
- 批  准
- 版本
- 工艺
- 日  期
- 第    页
- 共    页

### Library data of the parts
C34-C47 C71 C79 = Cap: Capacitor; Published: 8-Jun-2000; LatestRevisionDate: 17-Jul-2002; LatestRevisionNote: Re-released for DXP Platform.; PackageReference: RAD-0.3; Publisher: Altium Limited
C49-C52 C75 = CAP_1: value: C0805
D10-D13 = Diode 1N4148: High Conductance Fast Diode; Published: 8-Jun-2000; LatestRevisionDate: 17-Jul-2002; LatestRevisionNote: Re-released for DXP Platform.; DatasheetDocument: 1997; PackageReference: DO-35; Publisher: Altium Limited; Code_JEDEC: DO-204-AH; ComponentLink1Description: Manufacturer Link; ComponentLink1URL: http://www.fairchildsemi.com/; ComponentLink2Description: Datasheet; ComponentLink2URL: http://www.fairchildsemi.com/ds/1N%2F1N4148.pdf
J4#1 = 4 HEADER: 4 Pin Header
J10 = D Connector 9: Receptacle Assembly, 9 Position, Right Angle; PackageDocument: O; Positions: 9; Published: 15-Jun-2001; LatestRevisionDate: 17-Jul-2002; LatestRevisionNote: Re-released for DXP Platform.; DatasheetDocument: 1-Sep-1999; PackageReference: 788750; Publisher: Altium Limited; Orientation: Right Angle; Gender: Receptacle
L5 = Inductance: 10X10_smd_5%
L6 = BEADS: Value: L0603
L7 = BEADS
R7 R64-R78 R80 R81 R86-R95 = Res1: Resistor; Published: 8-Jun-2000; LatestRevisionDate: 17-Jul-2002; LatestRevisionNote: Re-released for DXP Platform.; PackageReference: AXIAL-0.3; Publisher: Altium Limited
  R64-R78 R80 R81 R86-R95: PackageDescription: Axial Device, Thru-Hole; 2 Leads; 0.3 in Pin Spacing
R82 R83 = Res1: R0603; Published: 8-Jun-2000; LatestRevisionDate: 17-Jul-2002; LatestRevisionNote: Re-released for DXP Platform.; PackageReference: AXIAL-0.3; Publisher: Altium Limited; PackageDescription: Axial Device, Thru-Hole; 2 Leads; 0.3 in Pin Spacing; Value: R0603
R85 = Res1: Resistor; Value: R0603; Published: 8-Jun-2000; LatestRevisionDate: 17-Jul-2002; LatestRevisionNote: Re-released for DXP Platform.; PackageReference: AXIAL-0.3; Publisher: Altium Limited; PackageDescription: Axial Device, Thru-Hole; 2 Leads; 0.3 in Pin Spacing
U8 = AR8031: Atheros  10/100/1000 Gigabit Ethernet
U10 = MAX3232E: TI SOIC16
X3 = XTAL: X3225_20ppm

## Sheet Power & SD.SchDoc
size A3
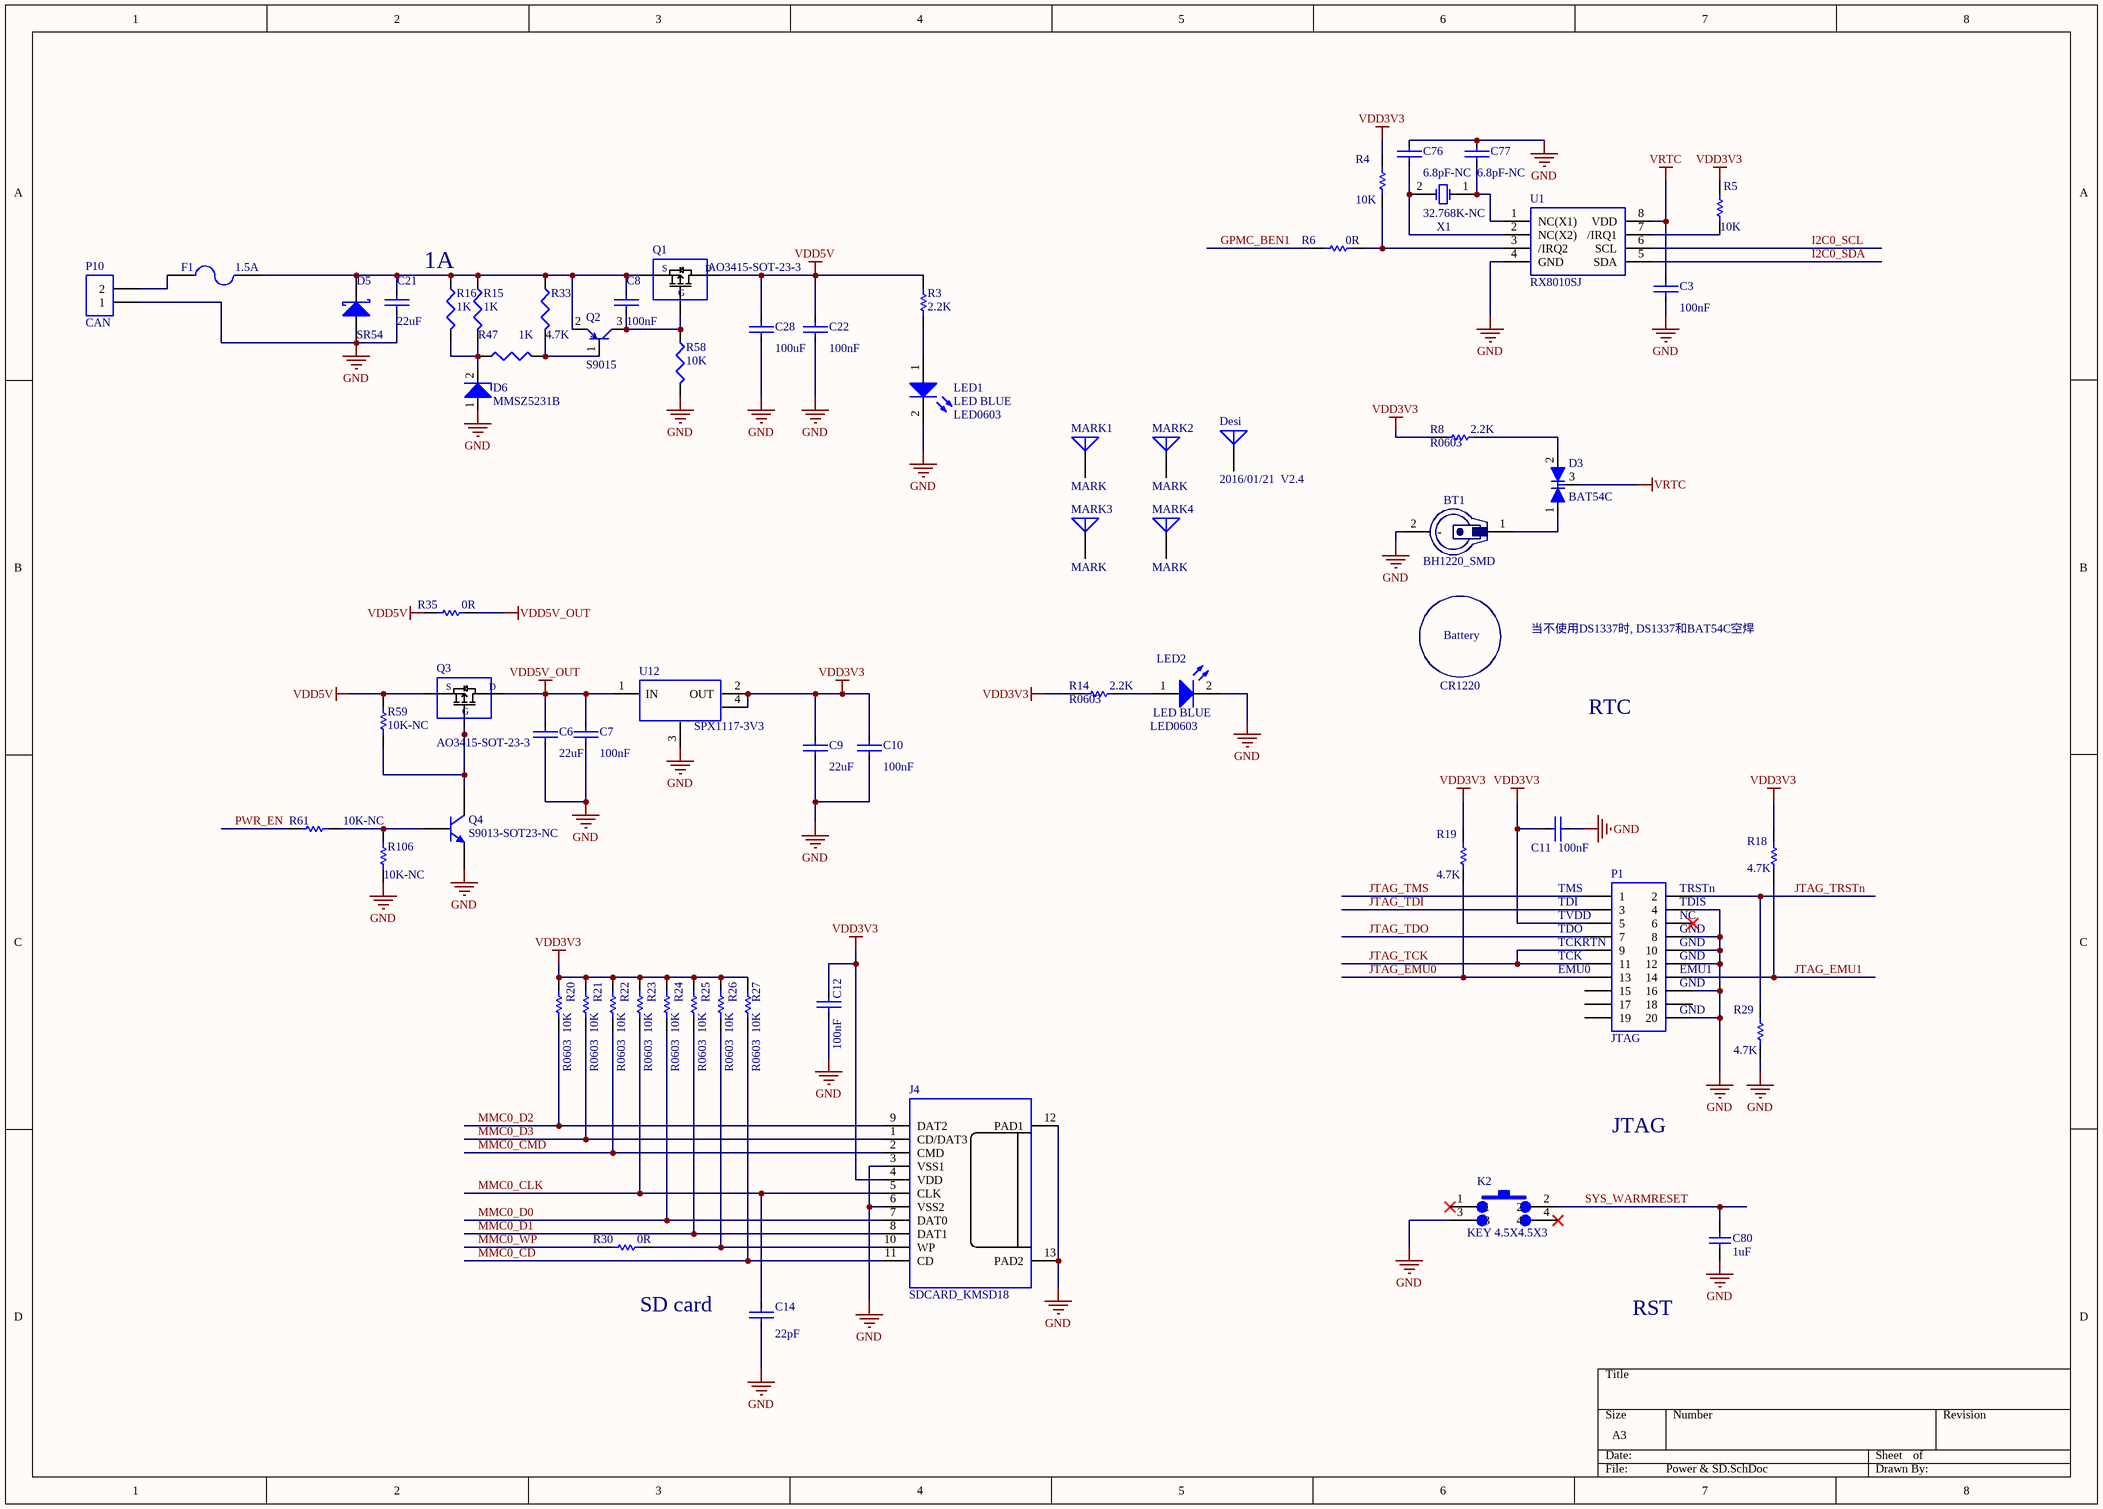
[diagram p4: Power & SD.SchDoc]

### Parts
(Parts that share a designator on the sheet are numbered #1, #2 ... from top to bottom, then left to right.)
BT1  BH1220_SMD  [BH-1220 Battery]
C3  100nF  [C0603_M1608]
C6  22uF  [C1210_M3225]
C7  100nF  [C0603_M1608]
C8  100nF  [C0603_M1608]
C9  22uF  [C1210_M3225]
C10  100nF  [C0603_M1608]
C11  100nF  [C0603_M1608]
C12  100nF  [C0603_M1608]
C14  22pF  [C0603_M1608]
C21  22uF  [C1210_M3225]
C22  100nF  [C0603_M1608]
C28  100uF  [C1210_M3225]
C76  6.8pF-NC  [C0603_M1608]
C77  6.8pF-NC  [C0603_M1608]
C80  value 1uF  [C0603_M1608]  (hidden comment: C0603)
D3  BAT54C  [SOT23-3D-C95P280X100]
D5  SR54  [SMB/DO-214AA]
D6  MMSZ5231B  [SOD123]
Desi  2016/01/21  V2.4  [LOGO]
F1  value 1.5A  [R_1210]  (hidden comment: Fuse 2)
J4#2  SDCARD_KMSD18  [SDcard_KDMS18]
K2  KEY 4.5X4.5X3  [SWPB-4]
LED1  LED BLUE  value LED0603  [LED0603_M1608]
LED2  LED BLUE  value LED0603  [LED0603_M1608]
MARK1  MARK  [MARK]
MARK2  MARK  [MARK]
MARK3  MARK  [MARK]
MARK4  MARK  [MARK]
P1  JTAG  [IDC20S]
P10  CAN  [2EDGKA-5.08-2P]
Q1  AO3415-SOT-23-3  [SOT23]
Q2  S9015  [SOT23]
Q3  AO3415-SOT-23-3  [SOT23]
Q4  S9013-SOT23-NC  [SOT23]
R3  2.2K  [R0603_M1608]
R4  10K  [R0603_M1608]
R5  10K  [R0603_M1608]
R6  0R  [R0603_M1608]
R8  2.2K  value R0603  [R0603_M1608]
R14  2.2K  value R0603  [R0603_M1608]
R15  value 1K  [0603]  (hidden comment: Res3)
R16  value 1K  [0603]  (hidden comment: Res3)
R18  4.7K  [R0603_M1608]
R19  4.7K  [R0603_M1608]
R20  10K  value R0603  [R0603_M1608]
R21  10K  value R0603  [R0603_M1608]
R22  10K  value R0603  [R0603_M1608]
R23  10K  value R0603  [R0603_M1608]
R24  10K  value R0603  [R0603_M1608]
R25  10K  value R0603  [R0603_M1608]
R26  10K  value R0603  [R0603_M1608]
R27  10K  value R0603  [R0603_M1608]
R29  4.7K  [R0603_M1608]
R30  0R  [R0603_M1608]
R33  value 4.7K  [0603]  (hidden comment: Res3)
R35  0R  [R0603_M1608]
R47  value 1K  [0603]  (hidden comment: Res3)
R58  value 10K  [0603]  (hidden comment: Res3)
R59  10K-NC  [R0603_M1608]
R61  10K-NC  [R0603_M1608]
R106  10K-NC  [R0603_M1608]
U1  RX8010SJ  [SOP-8 - RX8010SJ]
U12  value SPX1117-3V3  [LM1117]  (hidden comment: LM1117)
X1  32.768K-NC  [CRYSTALS_3215_2PIN]

### Nets
GND: BT1.2(-) C3.2 C6.2 C7.2 C9.2 C10.2 C11.2 C12.2 C14.2 C21.2 C22.2 C28.2 C76.1 C77.1 C80.1 D5.1(A) D6.1(A) J4#2.3(VSS1) J4#2.6(VSS2) J4#2.12(PAD1) J4#2.13(PAD2) K2.3 LED1.2(K) LED2.2(K) P1.4 P1.8 P1.10 P1.12 P1.16 P1.20 P10.1 Q4.2(E) R29.2 R58.2 R106.2 U1.4(GND) U12.3(GND)
VDD3V3: C9.1 C10.1 C11.1 C12.1 J4#2.4(VDD) P1.5 R4.1 R5.1 R8.2 R14.2 R18.1 R19.1 R20.1 R21.1 R22.1 R23.1 R24.1 R25.1 R26.1 R27.1 U12.2(OUT) U12.4
VDD5V: C22.1 C28.1 Q1.3(D) Q3.2(S) R3.2 R35.2 R59.2
VDD5V_OUT: C6.1 C7.1 Q3.3(D) R35.1 U12.1(IN)
VRTC: C3.1 D3.3 U1.8(VDD)
GPMC_BEn1: R6.2
I2C0_SCL: U1.6(SCL)
I2C0_SDA: U1.5(SDA)
JTAG_EMU0: P1.13 R19.2
JTAG_EMU1: P1.14 R18.2
JTAG_TCK: P1.9 P1.11
JTAG_TDI: P1.3
JTAG_TDO: P1.7
JTAG_TMS: P1.1
JTAG_TRSTn: P1.2 R29.1
MMC0_CD: J4#2.11(CD) R27.2
MMC0_CLK: C14.1 J4#2.5(CLK) R23.2
MMC0_CMD: J4#2.2(CMD) R22.2
MMC0_D0: J4#2.7(DAT0) R24.2
MMC0_D1: J4#2.8(DAT1) R25.2
MMC0_D2: J4#2.9(DAT2) R20.2
MMC0_D3: J4#2.1(CD/DAT3) R21.2
MMC0_WP: R30.2  [project net GPMC_CSn3]
PWR_EN: R61.2
SYS_WARMRESET: C80.2 K2.2
NetBT1_1: BT1.1(+) D3.1
NetC8_1: C8.1 C21.1 D5.2(K) F1.2 Q1.2(S) Q2.2(E) R15.1 R16.1 R33.1
NetC8_2: C8.2 Q1.1(G) Q2.3(C) R58.1
NetC76_2: C76.2 U1.2(NC(X2)) X1.2(OSC2)
NetC77_2: C77.2 U1.1(NC(X1)) X1.1(OSC1)
NetD3_2: D3.2 R8.1
NetD6_2: D6.2(K) R15.2 R16.2 R47.1
NetF1_1: F1.1 P10.2
NetJ4#2_10: J4#2.10(WP) R26.2 R30.1
NetLED1_1: LED1.1(A) R3.1
NetLED2_1: LED2.1(A) R14.1
NetQ2_1: Q2.1(B) R33.2 R47.2
NetQ3_1: Q3.1(G) Q4.3(C) R59.1
NetQ4_1: Q4.1(B) R61.1 R106.1
NetR4_2: R4.2 R6.1 U1.3(/IRQ2)
NetR5_2: R5.2 U1.7(/IRQ1)

Not connected (* = marked no-connect by the designer): Desi 1(A); K2 1* 4*; MARK1 1(A); MARK2 1(A); MARK3 1(A); MARK4 1(A); P1 6* 15 17 18 19

### Notes on the sheet
- 1A
- Battery
- 当不使用DS1337时, DS1337和BAT54C空焊
- CR1220
- RTC
- TMS
- (near P1) TDI
- (near P1) TVDD
- (near P1) TRSTn
- (near P1) TDIS
- (near P1) NC
- (near P1) TDO
- (near P1) TCKRTN
- (near P1) TCK
- (near P1) EMU0
- (near P1) GND
- (near P1) EMU1
- JTAG
- SD card
- RST

### Library data of the parts
BT1 = Battery
C3 C6-C12 C14 C21 C22 C28 C76 C77 = CAP_1: value: C0805
C80 = Cap: Capacitor; Published: 8-Jun-2000; LatestRevisionDate: 17-Jul-2002; LatestRevisionNote: Re-released for DXP Platform.; PackageReference: RAD-0.3; Publisher: Altium Limited
D3 = BAT54C: SOT23-3_D
D5 = Diode 11DQ03: Schottky Rectifier; Published: 8-Jun-2000; LatestRevisionDate: 17-Jul-2002; LatestRevisionNote: Re-released for DXP Platform.; DatasheetVersion: Dec-1997; PackageReference: DO-204AL; Publisher: Altium Limited; PackageDescription: Diode, Axial; Body 5.2 x 2.7 mm (LxDia. max), Lead Dia. 0.86 mm (max); Code_JEDEC: DO-204-AL; ComponentLink1Description: Manufacturer Link; ComponentLink1URL: http://www.irf.com/; ComponentLink2Description: Datasheet; ComponentLink2URL: http://www.irf.com/product-info/datasheets/data/11dq03.pdf
D6 = DIODE_ZENER
Desi MARK1-MARK4 = Antenna: Generic Antenna; Published: 24-Mar-1999; LatestRevisionDate: 17-Jul-2002; LatestRevisionNote: Re-released for DXP Platform.; PackageReference: PIN1; Publisher: Altium Limited
F1 = Fuse 2: Fuse; Published: 8-Jun-2000; LatestRevisionDate: 17-Jul-2002; LatestRevisionNote: Re-released for DXP Platform.; PackageReference: PIN-W2/E2.8; Publisher: Altium Limited; PackageDescription: Thru-Hole; 2 Leads
LED1 LED2 = LED2: Typical RED, GREEN, YELLOW, AMBER GaAs LED; Published: 8-Jun-2000; LatestRevisionDate: 17-Jul-2002; LatestRevisionNote: Re-released for DXP Platform.; PackageVersion: Feb-2002; PackageReference: 3.2X1.6X1.1; Publisher: Altium Limited; PackageDescription: SM LED; 2 Flat Leads
P1 = Header 10X2: Header, 10-Pin, Dual row; LatestRevisionDate: 17-Jul-2002; LatestRevisionNote: Re-released for DXP Platform.; Publisher: Altium Limited
P10 = Header 2: Header, 2-Pin; LatestRevisionDate: 17-Jul-2002; LatestRevisionNote: Re-released for DXP Platform.; Publisher: Altium Limited
Q1 Q3 = AO3415
Q2 = PNP_S
Q4 = S9013
R3-R6 R8 R14 R18-R27 R29 R30 R35 R59 R61 R106 = Res1: R0603; Published: 8-Jun-2000; LatestRevisionDate: 17-Jul-2002; LatestRevisionNote: Re-released for DXP Platform.; PackageReference: AXIAL-0.3; Publisher: Altium Limited; PackageDescription: Axial Device, Thru-Hole; 2 Leads; 0.3 in Pin Spacing
  R3-R6 R18 R19 R29 R30 R35 R59 R61 R106: Value: R0603
R15 R16 R33 R47 R58 = Res3: Resistor; Published: 8-Jun-2000; LatestRevisionDate: 29-May-2009; LatestRevisionNote: IPC-7351 Footprint Added.; PackageReference: J1-0603; Publisher: Altium Limited; PackageDescription: Chip Resistor
X1 = XTAL: Crystal Oscillator; Published: 8-Jun-2000; LatestRevisionDate: 17-Jul-2002; LatestRevisionNote: Re-released for DXP Platform.; PackageReference: R38; Publisher: Altium Limited

## Sheet SDIO_WIFI.SchDoc
size A4
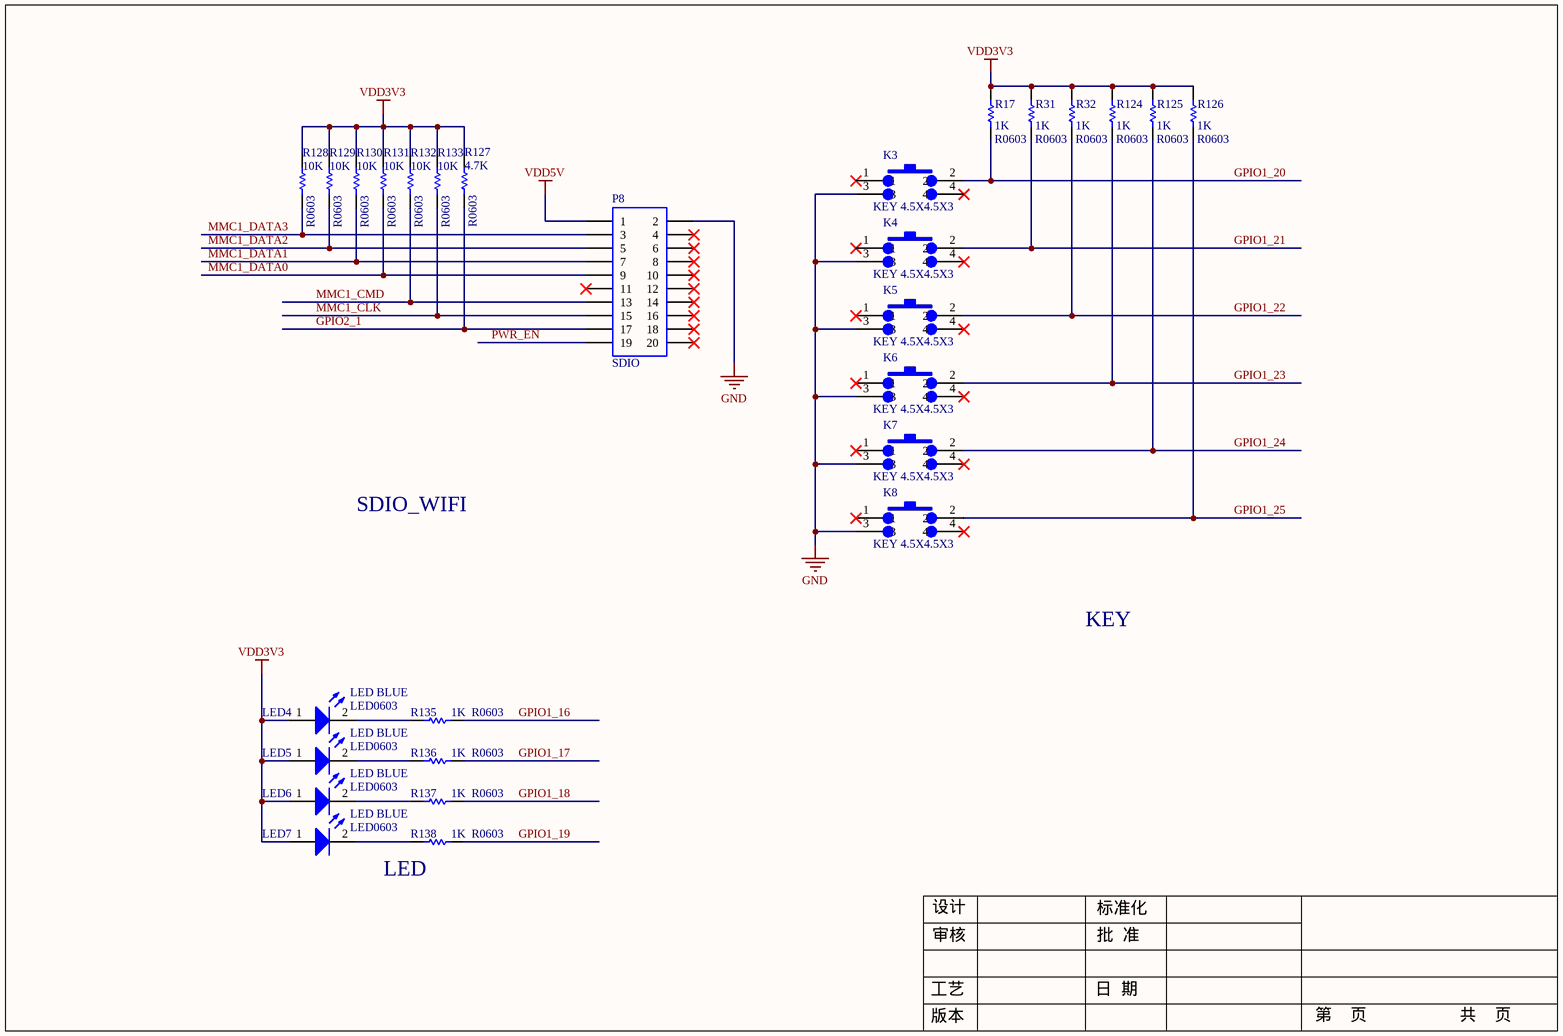
[diagram p5: SDIO_WIFI.SchDoc]

### Parts
K3  KEY 4.5X4.5X3  [SWPB-4]
K4  KEY 4.5X4.5X3  [SWPB-4]
K5  KEY 4.5X4.5X3  [SWPB-4]
K6  KEY 4.5X4.5X3  [SWPB-4]
K7  KEY 4.5X4.5X3  [SWPB-4]
K8  KEY 4.5X4.5X3  [SWPB-4]
LED4  LED BLUE  value LED0603  [LED0603_M1608]
LED5  LED BLUE  value LED0603  [LED0603_M1608]
LED6  LED BLUE  value LED0603  [LED0603_M1608]
LED7  LED BLUE  value LED0603  [LED0603_M1608]
P8  SDIO  [IDC20S]
R17  1K  value R0603  [R0603_M1608]
R31  1K  value R0603  [R0603_M1608]
R32  1K  value R0603  [R0603_M1608]
R124  1K  value R0603  [R0603_M1608]
R125  1K  value R0603  [R0603_M1608]
R126  1K  value R0603  [R0603_M1608]
R127  4.7K  value R0603  [R0603_M1608]
R128  10K  value R0603  [R0603_M1608]
R129  10K  value R0603  [R0603_M1608]
R130  10K  value R0603  [R0603_M1608]
R131  10K  value R0603  [R0603_M1608]
R132  10K  value R0603  [R0603_M1608]
R133  10K  value R0603  [R0603_M1608]
R135  1K  value R0603  [R0603_M1608]
R136  1K  value R0603  [R0603_M1608]
R137  1K  value R0603  [R0603_M1608]
R138  1K  value R0603  [R0603_M1608]

### Nets
GND: K3.3 K4.3 K5.3 K6.3 K7.3 K8.3 P8.2
VDD3V3: LED4.1(A) LED5.1(A) LED6.1(A) LED7.1(A) R17.1 R31.1 R32.1 R124.1 R125.1 R126.1 R127.1 R128.1 R129.1 R130.1 R131.1 R132.1 R133.1
VDD5V: P8.1
GPIO1_16: R135.2
GPIO1_17: R136.2
GPIO1_18: R137.2
GPIO1_19: R138.2
GPIO1_20: K3.2 R17.2
GPIO1_21: K4.2 R31.2
GPIO1_22: K5.2 R32.2
GPIO1_23: K6.2 R124.2
GPIO1_24: K7.2 R125.2
GPIO1_25: K8.2 R126.2
GPIO2_1: P8.17 R127.2
MMC1_CLK: P8.15 R133.2  [project net GPMC_CSn1]
MMC1_CMD: P8.13 R132.2  [project net GPMC_CSn2]
MMC1_DATA0: P8.9 R131.2  [project net GPMC_D8]
MMC1_DATA1: P8.7 R130.2  [project net GPMC_D9]
MMC1_DATA2: P8.5 R129.2  [project net GPMC_D10]
MMC1_DATA3: P8.3 R128.2  [project net GPMC_D11]
PWR_EN: P8.19
NetLED4_2: LED4.2(K) R135.1
NetLED5_2: LED5.2(K) R136.1
NetLED6_2: LED6.2(K) R137.1
NetLED7_2: LED7.2(K) R138.1

Not connected (* = marked no-connect by the designer): K3 1* 4*; K4 1* 4*; K5 1* 4*; K6 1* 4*; K7 1* 4*; K8 1* 4*; P8 4* 6* 8* 10* 11* 12* 14* 16* 18* 20*

### Notes on the sheet
- SDIO_WIFI
- KEY
- (near R138) LED
- 设计
- 标准化
- 审核
- 批  准
- 版本
- 工艺
- 日  期
- 第    页
- 共    页

### Library data of the parts
LED4-LED7 = LED2: as LED1 on sheet Power & SD; Published: 8-Jun-2000; LatestRevisionDate: 17-Jul-2002; LatestRevisionNote: Re-released for DXP Platform.; PackageVersion: Feb-2002; PackageReference: 3.2X1.6X1.1; Publisher: Altium Limited; PackageDescription: SM LED; 2 Flat Leads
P8 = Header 10X2: Header, 10-Pin, Dual row; LatestRevisionDate: 17-Jul-2002; LatestRevisionNote: Re-released for DXP Platform.; Publisher: Altium Limited
R17 R31 R32 R124-R126 R135-R138 = Res1: R0603; Published: 8-Jun-2000; LatestRevisionDate: 17-Jul-2002; LatestRevisionNote: Re-released for DXP Platform.; PackageReference: AXIAL-0.3; Publisher: Altium Limited; PackageDescription: Axial Device, Thru-Hole; 2 Leads; 0.3 in Pin Spacing
R127-R133 = Res1: Resistor; Published: 8-Jun-2000; LatestRevisionDate: 17-Jul-2002; LatestRevisionNote: Re-released for DXP Platform.; PackageReference: AXIAL-0.3; Publisher: Altium Limited; PackageDescription: Axial Device, Thru-Hole; 2 Leads; 0.3 in Pin Spacing

## Sheet SODIMM.SchDoc
size 393 x 281 mm
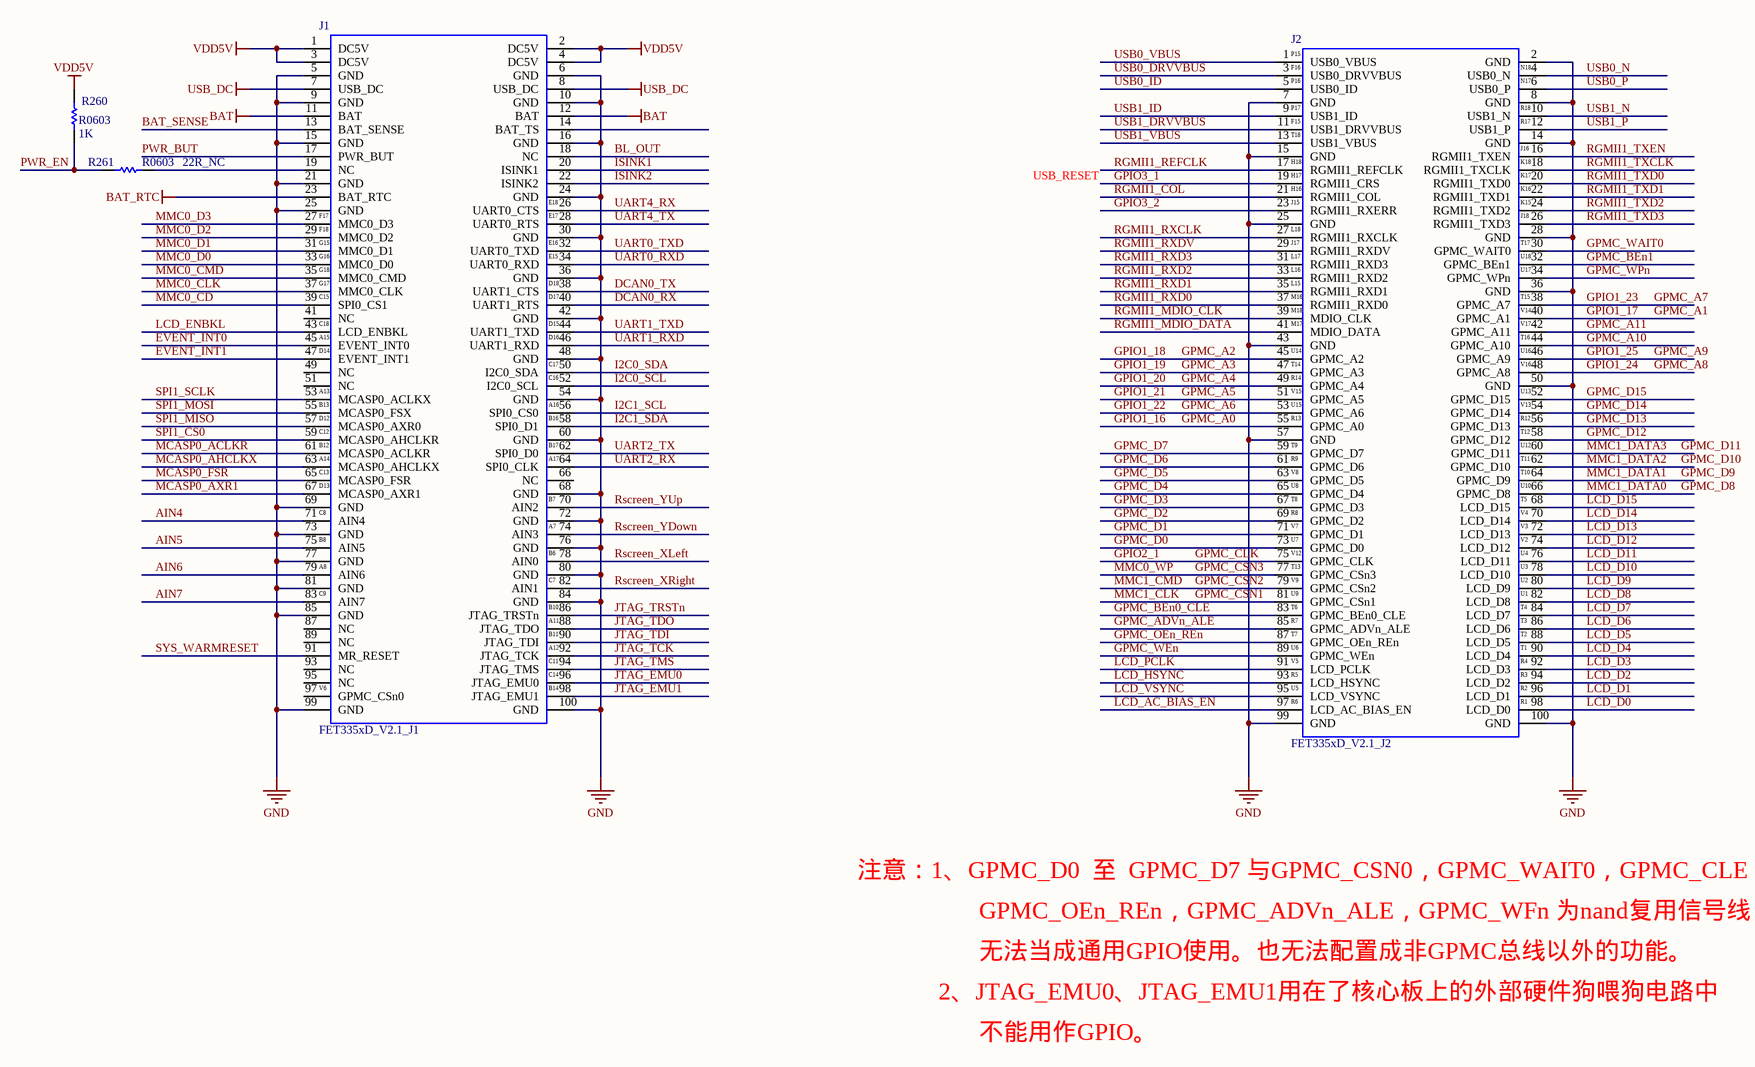
[diagram p6: SODIMM.SchDoc]

### Parts
J1  FET335xD_V2.1_J1  [1.27MM SMT CONNECT PIN]
J2  FET335xD_V2.1_J2  [1.27MM SMT CONNECT PIN]
R260  R0603  value 1K  [R0603_M1608]
R261  R0603  value 22R_NC  [R0603_M1608]

### Nets
BAT: J1.11(BAT) J1.12(BAT)
BAT_RTC: J1.23(BAT_RTC)
GND: J1.5(GND) J1.6(GND) J1.9(GND) J1.10(GND) J1.15(GND) J1.16(GND) J1.21(GND) J1.24(GND) J1.25(GND) J1.30(GND) J1.36(GND) J1.42(GND) J1.48(GND) J1.54(GND) J1.60(GND) J1.68(GND) J1.69(GND) J1.72(GND) J1.73(GND) J1.76(GND) J1.77(GND) J1.80(GND) J1.81(GND) J1.84(GND) J1.85(GND) J1.99(GND) J1.100(GND) J2.2(GND) J2.7(GND) J2.8(GND) J2.14(GND) J2.15(GND) J2.25(GND) J2.28(GND) J2.36(GND) J2.43(GND) J2.50(GND) J2.57(GND) J2.99(GND) J2.100(GND)
USB_DC: J1.7(USB_DC) J1.8(USB_DC)
VDD5V: J1.1(DC5V) J1.2(DC5V) J1.3(DC5V) J1.4(DC5V) R260.1
AIN4: J1.71(AIN4)
AIN5: J1.75(AIN5)
AIN6: J1.79(AIN6)
AIN7: J1.83(AIN7)
BAT_SENSE: J1.13(BAT_SENSE)
BL_OUT: J1.18(NC)
DCAN0_RX: J1.40(UART1_RTS)
DCAN0_TX: J1.38(UART1_CTS)
EVENT_INT0: J1.45(EVENT_INT0)
EVENT_INT1: J1.47(EVENT_INT1)
GPIO1_16: J2.55(GPMC_A0)  [also labelled GPMC_A0]
GPIO1_17: J2.40(GPMC_A1)  [also labelled GPMC_A1]
GPIO1_18: J2.45(GPMC_A2)  [also labelled GPMC_A2]
GPIO1_19: J2.47(GPMC_A3)  [also labelled GPMC_A3]
GPIO1_20: J2.49(GPMC_A4)  [also labelled GPMC_A4]
GPIO1_21: J2.51(GPMC_A5)  [also labelled GPMC_A5]
GPIO1_22: J2.53(GPMC_A6)  [also labelled GPMC_A6]
GPIO1_23: J2.38(GPMC_A7)  [also labelled GPMC_A7]
GPIO1_24: J2.48(GPMC_A8)  [also labelled GPMC_A8]
GPIO1_25: J2.46(GPMC_A9)  [also labelled GPMC_A9]
GPIO2_1: J2.75(GPMC_CLK)  [also labelled GPMC_CLK]
GPIO3_1: J2.19(RGMII1_CRS)
GPIO3_2: J2.23(RGMII1_RXERR)
GPMC_A10: J2.44(GPMC_A10)
GPMC_A11: J2.42(GPMC_A11)
GPMC_ADVn_ALE: J2.85(GPMC_ADVn_ALE)
GPMC_BEn0_CLE: J2.83(GPMC_BEn0_CLE)
GPMC_BEn1: J2.32(GPMC_BEn1)
GPMC_CSn1: J2.81(GPMC_CSn1)  [also labelled MMC1_CLK]
GPMC_CSn2: J2.79(GPMC_CSn2)  [also labelled MMC1_CMD]
GPMC_CSn3: J2.77(GPMC_CSn3)  [also labelled MMC0_WP]
GPMC_D0: J2.73(GPMC_D0)
GPMC_D1: J2.71(GPMC_D1)
GPMC_D2: J2.69(GPMC_D2)
GPMC_D3: J2.67(GPMC_D3)
GPMC_D4: J2.65(GPMC_D4)
GPMC_D5: J2.63(GPMC_D5)
GPMC_D6: J2.61(GPMC_D6)
GPMC_D7: J2.59(GPMC_D7)
GPMC_D8: J2.66(GPMC_D8)  [also labelled MMC1_DATA0]
GPMC_D9: J2.64(GPMC_D9)  [also labelled MMC1_DATA1]
GPMC_D10: J2.62(GPMC_D10)  [also labelled MMC1_DATA2]
GPMC_D11: J2.60(GPMC_D11)  [also labelled MMC1_DATA3]
GPMC_D12: J2.58(GPMC_D12)
GPMC_D13: J2.56(GPMC_D13)
GPMC_D14: J2.54(GPMC_D14)
GPMC_D15: J2.52(GPMC_D15)
GPMC_OEn_REn: J2.87(GPMC_OEn_REn)
GPMC_WAIT0: J2.30(GPMC_WAIT0)
GPMC_WEn: J2.89(GPMC_WEn)
GPMC_WPn: J2.34(GPMC_WPn)
I2C0_SCL: J1.52(I2C0_SCL)
I2C0_SDA: J1.50(I2C0_SDA)
I2C1_SCL: J1.56(SPI0_CS0)
I2C1_SDA: J1.58(SPI0_D1)
ISINK1: J1.20(ISINK1)
ISINK2: J1.22(ISINK2)
JTAG_EMU0: J1.96(JTAG_EMU0)
JTAG_EMU1: J1.98(JTAG_EMU1)
JTAG_TCK: J1.92(JTAG_TCK)
JTAG_TDI: J1.90(JTAG_TDI)
JTAG_TDO: J1.88(JTAG_TDO)
JTAG_TMS: J1.94(JTAG_TMS)
JTAG_TRSTn: J1.86(JTAG_TRSTn)
LCD_AC_BIAS_EN: J2.97(LCD_AC_BIAS_EN)
LCD_D0: J2.98(LCD_D0)
LCD_D1: J2.96(LCD_D1)
LCD_D2: J2.94(LCD_D2)
LCD_D3: J2.92(LCD_D3)
LCD_D4: J2.90(LCD_D4)
LCD_D5: J2.88(LCD_D5)
LCD_D6: J2.86(LCD_D6)
LCD_D7: J2.84(LCD_D7)
LCD_D8: J2.82(LCD_D8)
LCD_D9: J2.80(LCD_D9)
LCD_D10: J2.78(LCD_D10)
LCD_D11: J2.76(LCD_D11)
LCD_D12: J2.74(LCD_D12)
LCD_D13: J2.72(LCD_D13)
LCD_D14: J2.70(LCD_D14)
LCD_D15: J2.68(LCD_D15)
LCD_ENBKL: J1.43(LCD_ENBKL)
LCD_HSYNC: J2.93(LCD_HSYNC)
LCD_PCLK: J2.91(LCD_PCLK)
LCD_VSYNC: J2.95(LCD_VSYNC)
MCASP0_ACLKR: J1.61(MCASP0_ACLKR)
MCASP0_AHCLKX: J1.63(MCASP0_AHCLKX)
MCASP0_AXR1: J1.67(MCASP0_AXR1)
MCASP0_FSR: J1.65(MCASP0_FSR)
MMC0_CD: J1.39(SPI0_CS1)
MMC0_CLK: J1.37(MMC0_CLK)
MMC0_CMD: J1.35(MMC0_CMD)
MMC0_D0: J1.33(MMC0_D0)
MMC0_D1: J1.31(MMC0_D1)
MMC0_D2: J1.29(MMC0_D2)
MMC0_D3: J1.27(MMC0_D3)
PWR_BUT: J1.17(PWR_BUT)
PWR_EN: R260.2 R261.1
RGMII1_COL: J2.21(RGMII1_COL)
RGMII1_MDIO_CLK: J2.39(MDIO_CLK)
RGMII1_MDIO_DATA: J2.41(MDIO_DATA)
RGMII1_REFCLK: J2.17(RGMII1_REFCLK)
RGMII1_RXCLK: J2.27(RGMII1_RXCLK)
RGMII1_RXD0: J2.37(RGMII1_RXD0)
RGMII1_RXD1: J2.35(RGMII1_RXD1)
RGMII1_RXD2: J2.33(RGMII1_RXD2)
RGMII1_RXD3: J2.31(RGMII1_RXD3)
RGMII1_RXDV: J2.29(RGMII1_RXDV)
RGMII1_TXCLK: J2.18(RGMII1_TXCLK)
RGMII1_TXD0: J2.20(RGMII1_TXD0)
RGMII1_TXD1: J2.22(RGMII1_TXD1)
RGMII1_TXD2: J2.24(RGMII1_TXD2)
RGMII1_TXD3: J2.26(RGMII1_TXD3)
RGMII1_TXEN: J2.16(RGMII1_TXEN)
Rscreen_XLeft: J1.78(AIN0)
Rscreen_XRight: J1.82(AIN1)
Rscreen_YDown: J1.74(AIN3)
Rscreen_YUp: J1.70(AIN2)
SPI1_CS0: J1.59(MCASP0_AHCLKR)
SPI1_MISO: J1.57(MCASP0_AXR0)
SPI1_MOSI: J1.55(MCASP0_FSX)
SPI1_SCLK: J1.53(MCASP0_ACLKX)
SYS_WARMRESET: J1.91(MR_RESET)
UART0_RXD: J1.34(UART0_RXD)
UART0_TXD: J1.32(UART0_TXD)
UART1_RXD: J1.46(UART1_RXD)
UART1_TXD: J1.44(UART1_TXD)
UART2_RX: J1.64(SPI0_CLK)
UART2_TX: J1.62(SPI0_D0)
UART4_RX: J1.26(UART0_CTS)
UART4_TX: J1.28(UART0_RTS)
USB0_DRVVBUS: J2.3(USB0_DRVVBUS)
USB0_ID: J2.5(USB0_ID)
USB0_N: J2.4(USB0_N)
USB0_P: J2.6(USB0_P)
USB0_VBUS: J2.1(USB0_VBUS)
USB1_DRVVBUS: J2.11(USB1_DRVVBUS)
USB1_ID: J2.9(USB1_ID)
USB1_N: J2.10(USB1_N)
USB1_P: J2.12(USB1_P)
USB1_VBUS: J2.13(USB1_VBUS)
NetJ1_19: J1.19(NC) R261.2

Not connected (* = marked no-connect by the designer): J1 14(BAT_TS) 41(NC) 49(NC) 51(NC) 66(NC) 87(NC) 89(NC) 93(NC) 95(NC) 97(GPMC_CSn0)

### Notes on the sheet
- USB_RESET
- 注意：1、GPMC_D0  至  GPMC_D7 与GPMC_CSN0，GPMC_WAIT0，GPMC_CLE
- GPMC_OEn_REn，GPMC_ADVn_ALE，GPMC_WFn 为nand复用信号线
- 无法当成通用GPIO使用。也无法配置成非GPMC总线以外的功能。
- 2、JTAG_EMU0、JTAG_EMU1用在了核心板上的外部硬件狗喂狗电路中
- 不能用作GPIO。
- 设计
- 标准化
- 审核
- 批  准
- 版本
- 工艺
- 日  期
- 第    页
- 共    页
- (in symbol FET335xD_V2.1_J1) E18; F17; E17; F18; G15; E16; G16; E15; G18; G17; D18; C15; D17; C18; D15; A15; D16; D14; C17; C16; A13; B13; A16; D12; B16; C12; B12; B17; A14; A17; C13; D13; B7; C8; A7; B8; B6; A8; C7; C9; B10; A11; B11; A12; C11; C14; V6; B14
- (in symbol FET335xD_V2.1_J2) P15; F16; N18; P16; N17; P17; R18; F15; R17; T18; J16; H18; K18; H17; K17; H16; K16; J15; K15; J18; L18; J17; T17; L17; U18; L16; U17; L15; M16; T15; M18; V14; M17; V17; T16; U14; U16; T14; V16; R14; V15; U13; U15; V13; R13; R12; T12; T9; U12; R9; T11; V8; T10; U8; U10; T8; T5; R8; V4; V7; V3; U7; V2; V12; U4; T13; U3; V9; U2; U9; U1; T6; T4; R7; T3; T7; T2; U6; T1; V5; R4; R5; R3; U5; R2; R6; R1

### Library data of the parts
R260 R261 = Res1: Resistor; Published: 8-Jun-2000; LatestRevisionDate: 17-Jul-2002; LatestRevisionNote: Re-released for DXP Platform.; PackageReference: AXIAL-0.3; Publisher: Altium Limited
J1 = FET335xD_V2.1_J1: Value: FET335xD_V2.1_J1
J2 = FET335xD_V2.1_J2: Value: FET335xD_V2.1_J2

## Sheet USB.SchDoc
size 431 x 254 mm
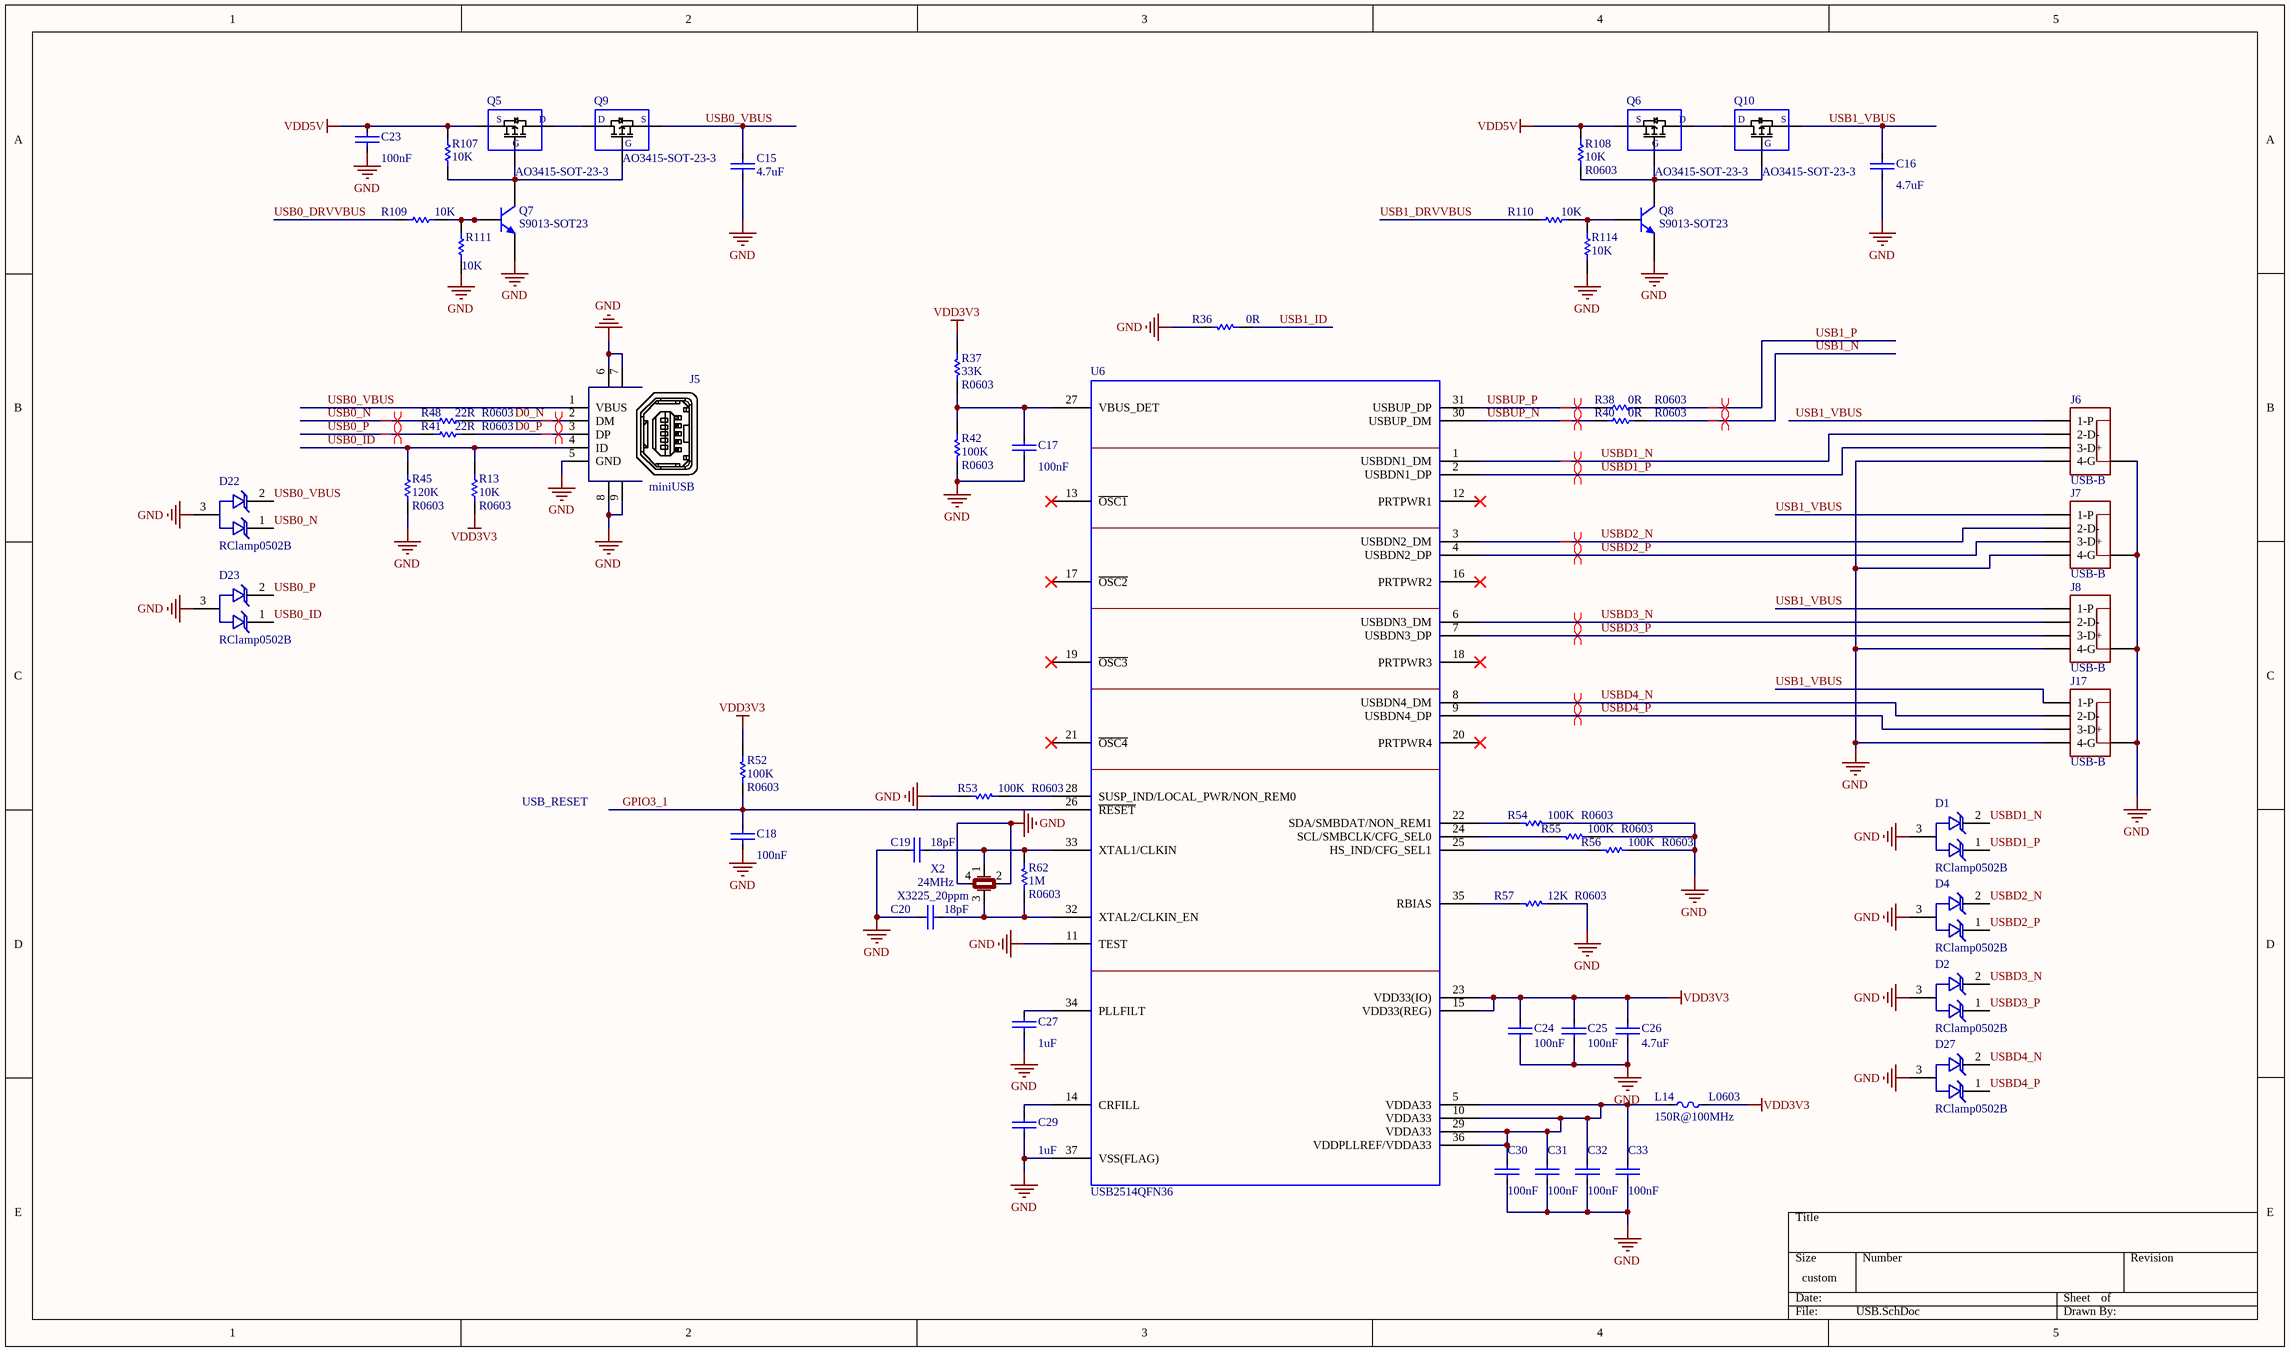
[diagram p7: USB.SchDoc]

### Parts
C15  4.7uF  [C0603_M1608]
C16  4.7uF  [C0603_M1608]
C17  100nF  [C0603_M1608]
C18  100nF  [C0603_M1608]
C19  18pF  [C0603_M1608]
C20  18pF  [C0603_M1608]
C23  100nF  [C0603_M1608]
C24  100nF  [C0603_M1608]
C25  100nF  [C0603_M1608]
C26  4.7uF  [C0603_M1608]
C27  1uF  [C0603_M1608]
C29  1uF  [C0603_M1608]
C30  100nF  [C0603_M1608]
C31  100nF  [C0603_M1608]
C32  100nF  [C0603_M1608]
C33  100nF  [C0603_M1608]
D1  value RClamp0502B  [SOT-523]  (hidden comment: LCTVS)
D2  value RClamp0502B  [SOT-523]  (hidden comment: LCTVS)
D4  value RClamp0502B  [SOT-523]  (hidden comment: LCTVS)
D22  value RClamp0502B  [SOT-523]  (hidden comment: LCTVS)
D23  value RClamp0502B  [SOT-523]  (hidden comment: LCTVS)
D27  value RClamp0502B  [SOT-523]  (hidden comment: LCTVS)
J5  miniUSB  [MiniUSB]
J6  USB-B  [USB-C]
J7  USB-B  [USB-C]
J8  USB-B  [USB-C]
J17  USB-B  [USB-C]
L14  150R@100MHz  value L0603  [L0603_M1608]
Q5  AO3415-SOT-23-3  [SOT23]
Q6  AO3415-SOT-23-3  [SOT23]
Q7  S9013-SOT23  [SOT23]
Q8  S9013-SOT23  [SOT23]
Q9  AO3415-SOT-23-3  [SOT23]
Q10  AO3415-SOT-23-3  [SOT23]
R13  10K  value R0603  [R0603_M1608]
R36  0R  [R0603_M1608]
R37  33K  value R0603  [R0603_M1608]
R38  0R  value R0603  [R0603_M1608]
R40  0R  value R0603  [R0603_M1608]
R41  22R  value R0603  [R0603_M1608]
R42  100K  value R0603  [R0603_M1608]
R45  120K  value R0603  [R0603_M1608]
R48  22R  value R0603  [R0603_M1608]
R52  100K  value R0603  [R0603_M1608]
R53  100K  value R0603  [R0603_M1608]
R54  100K  value R0603  [R0603_M1608]
R55  100K  value R0603  [R0603_M1608]
R56  100K  value R0603  [R0603_M1608]
R57  12K  value R0603  [R0603_M1608]
R62  1M  value R0603  [R0603_M1608]
R107  10K  [R0603_M1608]
R108  10K  value R0603  [R0603_M1608]
R109  10K  [R0603_M1608]
R110  10K  [R0603_M1608]
R111  10K  [R0603_M1608]
R114  10K  [R0603_M1608]
U6  USB2514QFN36  [QFN36(USB251x)]
X2  24MHz  value X3225_20ppm  [Crystals_3225]

### Nets
GND: C15.2 C16.2 C17.2 C18.1 C19.1 C20.1 C23.1 C24.2 C25.2 C26.2 C27.2 C29.2 C30.2 C31.2 C32.2 C33.2 D1.3 D2.3 D4.3 D22.3 D23.3 D27.3 J5.5(GND) J5.6 J5.7 J5.8 J5.9 J6.0 J6.4(4-G) J7.0 J7.4(4-G) J8.0 J8.4(4-G) J17.0 J17.4(4-G) Q7.2(E) Q8.2(E) R36.1 R42.1 R45.1 R53.1 R54.2 R55.2 R56.2 R57.2 R111.2 R114.2 U6.11(TEST) U6.37(VSS(FLAG)) X2.2 X2.4
VDD3V3: C24.1 C25.1 C26.1 L14.1 R13.1 R37.2 R52.2 U6.15(VDD33(REG)) U6.23(VDD33(IO))
VDD5V: C23.2 Q5.2(S) Q6.2(S) R107.2 R108.2
D0_N: J5.2(DM) R48.2
D0_P: J5.3(DP) R41.2
GPIO3_1: C18.2 R52.1 U6.26(~{RESET})
USB0_DRVVBUS: R109.2
USB0_ID: D23.1 J5.4(ID) R13.2 R45.2
USB0_N: D22.1 R48.1
USB0_P: D23.2 R41.1
USB0_VBUS: C15.1 D22.2 J5.1(VBUS) Q9.2(S)
USB1_DRVVBUS: R110.2
USB1_ID: R36.2
USB1_N: R40.2
USB1_P: R38.2
USB1_VBUS: C16.1 J6.1(1-P) J7.1(1-P) J8.1(1-P) J17.1(1-P) Q10.2(S)
USBD1_N: D1.2 J6.2(2-D-) U6.1(USBDN1_DM)
USBD1_P: D1.1 J6.3(3-D+) U6.2(USBDN1_DP)
USBD2_N: D4.2 J7.2(2-D-) U6.3(USBDN2_DM)
USBD2_P: D4.1 J7.3(3-D+) U6.4(USBDN2_DP)
USBD3_N: D2.2 J8.2(2-D-) U6.6(USBDN3_DM)
USBD3_P: D2.1 J8.3(3-D+) U6.7(USBDN3_DP)
USBD4_N: D27.2 J17.2(2-D-) U6.8(USBDN4_DM)
USBD4_P: D27.1 J17.3(3-D+) U6.9(USBDN4_DP)
USBUP_N: R40.1 U6.30(USBUP_DM)
USBUP_P: R38.1 U6.31(USBUP_DP)
NetC17_1: C17.1 R37.1 R42.2 U6.27(VBUS_DET)
NetC19_2: C19.2 R62.2 U6.33(XTAL1/CLKIN) X2.1
NetC20_2: C20.2 R62.1 U6.32(XTAL2/CLKIN_EN) X2.3
NetC27_1: C27.1 U6.34(PLLFILT)
NetC29_1: C29.1 U6.14(CRFILL)
NetC30_1: C30.1 C31.1 C32.1 C33.1 L14.2 U6.5(VDDA33) U6.10(VDDA33) U6.29(VDDA33) U6.36(VDDPLLREF/VDDA33)
NetQ5_1: Q5.1(G) Q7.3(C) Q9.1(G) R107.1
NetQ5_3: Q5.3(D) Q9.3(D)
NetQ6_1: Q6.1(G) Q8.3(C) Q10.1(G) R108.1
NetQ6_3: Q6.3(D) Q10.3(D)
NetQ7_1: Q7.1(B) R109.1 R111.1
NetQ8_1: Q8.1(B) R110.1 R114.1
NetR53_2: R53.2 U6.28(SUSP_IND/LOCAL_PWR/NON_REM0)
NetR54_1: R54.1 U6.22(SDA/SMBDAT/NON_REM1)
NetR55_1: R55.1 U6.24(SCL/SMBCLK/CFG_SEL0)
NetR56_1: R56.1 U6.25(HS_IND/CFG_SEL1)
NetR57_1: R57.1 U6.35(RBIAS)

Not connected (* = marked no-connect by the designer): U6 12(PRTPWR1)* 13(~{OSC1})* 16(PRTPWR2)* 17(~{OSC2})* 18(PRTPWR3)* 19(~{OSC3})* 20(PRTPWR4)* 21(~{OSC4})*

### Layout directives
differential pair: D0_N, D0_P, USB0_N, USB0_P, USB1_N, USB1_P, USBD1_N, USBD1_P, USBD2_N, USBD2_P, USBD3_N, USBD3_P, USBD4_N, USBD4_P, USBUP_N, USBUP_P

### Notes on the sheet
- USB_RESET

### Library data of the parts
C15-C20 C23-C27 C29-C33 = CAP_1: value: C0805
J6-J8 J17 = USB_B
L14 = BEADS: 0603
Q5 Q6 Q9 Q10 = AO3415
Q7 Q8 = S9013
R13 R36-R38 R40-R42 R45 R48 R52-R57 R62 R107-R111 R114 = Res1: R0603; Published: 8-Jun-2000; LatestRevisionDate: 17-Jul-2002; LatestRevisionNote: Re-released for DXP Platform.; PackageReference: AXIAL-0.3; Publisher: Altium Limited; PackageDescription: Axial Device, Thru-Hole; 2 Leads; 0.3 in Pin Spacing
  R36 R107 R109-R111 R114: Value: R0603
X2 = XTAL: X3225_20ppm

## Nets that join several sheets
GND: AD & i2C & SPI (16 pins), Audio (32 pins), LCD (25 pins), NET & UART (44 pins), Power & SD (37 pins), SDIO_WIFI (7 pins), SODIMM (40 pins), USB (51 pins)
VDD3V3: AD & i2C & SPI (7 pins), Audio (13 pins), LCD (P9.7), NET & UART (8 pins), Power & SD (22 pins), SDIO_WIFI (17 pins), USB (9 pins)
VDD5V: AD & i2C & SPI (8 pins), LCD (6 pins), NET & UART (J4#1.4), Power & SD (7 pins), SDIO_WIFI (P8.1), SODIMM (5 pins), USB (5 pins)
VDD5V_OUT: AD & i2C & SPI (C1.2 C2.2 U3.2 U18.2), Power & SD (5 pins)
AIN4: AD & i2C & SPI (P4.8), SODIMM (J1.71)
AIN5: AD & i2C & SPI (P4.3), SODIMM (J1.75)
AIN6: AD & i2C & SPI (P4.1), SODIMM (J1.79)
AIN7: AD & i2C & SPI (P4.2), SODIMM (J1.83)
DCAN0_RX: AD & i2C & SPI (R149.2 U17.2), SODIMM (J1.40)
DCAN0_TX: AD & i2C & SPI (U17.3), SODIMM (J1.38)
EVENT_INT0: LCD (J15.13), SODIMM (J1.45)
EVENT_INT1: LCD (J15.14), SODIMM (J1.47)
GPIO1_16: LCD (R120.3), SDIO_WIFI (R135.2), SODIMM (J2.55)
GPIO1_17: LCD (R12.2), SDIO_WIFI (R136.2), SODIMM (J2.40)
GPIO1_18: LCD (R11.2), SDIO_WIFI (R137.2), SODIMM (J2.45)
GPIO1_19: LCD (R11.4), SDIO_WIFI (R138.2), SODIMM (J2.47)
GPIO1_20: LCD (R10.1), SDIO_WIFI (K3.2 R17.2), SODIMM (J2.49)
GPIO1_21: LCD (R10.3), SDIO_WIFI (K4.2 R31.2), SODIMM (J2.51)
GPIO1_22: LCD (R120.1), SDIO_WIFI (K5.2 R32.2), SODIMM (J2.53)
GPIO1_23: LCD (R12.1), SDIO_WIFI (K6.2 R124.2), SODIMM (J2.38)
GPIO1_24: LCD (R11.3), SDIO_WIFI (K7.2 R125.2), SODIMM (J2.48)
GPIO1_25: LCD (R11.1), SDIO_WIFI (K8.2 R126.2), SODIMM (J2.46)
GPIO2_1: LCD (R2.1), SDIO_WIFI (P8.17 R127.2), SODIMM (J2.75)
GPIO3_1: SODIMM (J2.19), USB (C18.2 R52.1 U6.26)
GPMC_A10: LCD (R12.4), SODIMM (J2.44)
GPMC_A11: LCD (R12.3), SODIMM (J2.42)
GPMC_ADVn_ALE: LCD (R9.2), SODIMM (J2.85)
GPMC_BEn0_CLE: LCD (R9.1), SODIMM (J2.83)
GPMC_BEn1: LCD (R60.3), Power & SD (R6.2), SODIMM (J2.32)
GPMC_CSn1: LCD (R2.4), SDIO_WIFI (P8.15 R133.2), SODIMM (J2.81)
GPMC_CSn2: LCD (R2.3), SDIO_WIFI (P8.13 R132.2), SODIMM (J2.79)
GPMC_CSn3: LCD (R2.2), Power & SD (R30.2), SODIMM (J2.77)
GPMC_D0: LCD (R43.4), SODIMM (J2.73)
GPMC_D1: LCD (R43.3), SODIMM (J2.71)
GPMC_D2: LCD (R43.2), SODIMM (J2.69)
GPMC_D3: LCD (R43.1), SODIMM (J2.67)
GPMC_D4: LCD (R44.4), SODIMM (J2.65)
GPMC_D5: LCD (R44.2), SODIMM (J2.63)
GPMC_D6: LCD (R46.4), SODIMM (J2.61)
GPMC_D7: LCD (R46.2), SODIMM (J2.59)
GPMC_D8: LCD (R44.3), SDIO_WIFI (P8.9 R131.2), SODIMM (J2.66)
GPMC_D9: LCD (R44.1), SDIO_WIFI (P8.7 R130.2), SODIMM (J2.64)
GPMC_D10: LCD (R46.3), SDIO_WIFI (P8.5 R129.2), SODIMM (J2.62)
GPMC_D11: LCD (R46.1), SDIO_WIFI (P8.3 R128.2), SODIMM (J2.60)
GPMC_D12: LCD (R120.4), SODIMM (J2.58)
GPMC_D13: AD & i2C & SPI (P2.2), LCD (R120.2), SODIMM (J2.56)
GPMC_D14: AD & i2C & SPI (P3.2), LCD (R10.4), SODIMM (J2.54)
GPMC_D15: AD & i2C & SPI (P6.10), LCD (R10.2), SODIMM (J2.52)
GPMC_OEn_REn: LCD (R9.3), SODIMM (J2.87)
GPMC_WAIT0: LCD (R60.2), SODIMM (J2.30)
GPMC_WEn: LCD (R9.4), SODIMM (J2.89)
GPMC_WPn: LCD (R60.4), SODIMM (J2.34)
I2C0_SCL: AD & i2C & SPI (R156.2), Power & SD (U1.6), SODIMM (J1.52)
I2C0_SDA: AD & i2C & SPI (R157.2), Power & SD (U1.5), SODIMM (J1.50)
I2C1_SCL: AD & i2C & SPI (R142.1), Audio (R98.1 U11.1), LCD (J15.8), SODIMM (J1.56)
I2C1_SDA: AD & i2C & SPI (R143.1), Audio (R99.1 U11.2), LCD (J15.7), SODIMM (J1.58)
JTAG_EMU0: Power & SD (P1.13 R19.2), SODIMM (J1.96)
JTAG_EMU1: Power & SD (P1.14 R18.2), SODIMM (J1.98)
JTAG_TCK: Power & SD (P1.9 P1.11), SODIMM (J1.92)
JTAG_TDI: Power & SD (P1.3), SODIMM (J1.90)
JTAG_TDO: Power & SD (P1.7), SODIMM (J1.88)
JTAG_TMS: Power & SD (P1.1), SODIMM (J1.94)
JTAG_TRSTn: Power & SD (P1.2 R29.1), SODIMM (J1.86)
LCD_AC_BIAS_EN: LCD (J15.45), SODIMM (J2.97)
LCD_D0: LCD (J15.19), SODIMM (J2.98)
LCD_D1: AD & i2C & SPI (R119.1), LCD (J15.20), SODIMM (J2.96)
LCD_D2: AD & i2C & SPI (R116.1), LCD (J15.21), SODIMM (J2.94)
LCD_D3: AD & i2C & SPI (R117.1), LCD (J15.22), SODIMM (J2.92)
LCD_D4: LCD (J15.23), SODIMM (J2.90)
LCD_D5: LCD (J15.27), SODIMM (J2.88)
LCD_D6: LCD (J15.28), SODIMM (J2.86)
LCD_D7: LCD (J15.29), SODIMM (J2.84)
LCD_D8: LCD (J15.30), SODIMM (J2.82)
LCD_D9: LCD (J15.31), SODIMM (J2.80)
LCD_D10: LCD (J15.32), SODIMM (J2.78)
LCD_D11: LCD (J15.37), SODIMM (J2.76)
LCD_D12: LCD (J15.38), SODIMM (J2.74)
LCD_D13: LCD (J15.39), SODIMM (J2.72)
LCD_D14: LCD (J15.40), SODIMM (J2.70)
LCD_D15: LCD (J15.41), SODIMM (J2.68)
LCD_ENBKL: LCD (R140.1), SODIMM (J1.43)
LCD_HSYNC: LCD (J15.43), SODIMM (J2.93)
LCD_PCLK: LCD (C4.2 J15.47), SODIMM (J2.91)
LCD_VSYNC: LCD (J15.44), SODIMM (J2.95)
MCASP0_ACLKR: Audio (R97.1 U11.38), SODIMM (J1.61)
MCASP0_AHCLKX: Audio (U11.41), SODIMM (J1.63)
MCASP0_AXR1: Audio (U11.40), SODIMM (J1.67)
MCASP0_FSR: Audio (U11.39), SODIMM (J1.65)
MMC0_CD: Power & SD (J4#2.11 R27.2), SODIMM (J1.39)
MMC0_CLK: Power & SD (C14.1 J4#2.5 R23.2), SODIMM (J1.37)
MMC0_CMD: Power & SD (J4#2.2 R22.2), SODIMM (J1.35)
MMC0_D0: Power & SD (J4#2.7 R24.2), SODIMM (J1.33)
MMC0_D1: Power & SD (J4#2.8 R25.2), SODIMM (J1.31)
MMC0_D2: Power & SD (J4#2.9 R20.2), SODIMM (J1.29)
MMC0_D3: Power & SD (J4#2.1 R21.2), SODIMM (J1.27)
PWR_EN: AD & i2C & SPI (P2.9 P3.9 P4.9 P6.9), LCD (J15.6), Power & SD (R61.2), SDIO_WIFI (P8.19), SODIMM (R260.2 R261.1)
RGMII1_MDIO_CLK: NET & UART (R73.2), SODIMM (J2.39)
RGMII1_MDIO_DATA: NET & UART (R72.2 R74.2), SODIMM (J2.41)
RGMII1_RXCLK: NET & UART (R77.2 R91.2), SODIMM (J2.27)
RGMII1_RXD0: NET & UART (R68.2 R90.2), SODIMM (J2.37)
RGMII1_RXD1: NET & UART (R69.2 R92.2), SODIMM (J2.35)
RGMII1_RXD2: NET & UART (R70.2 R89.2), SODIMM (J2.33)
RGMII1_RXD3: NET & UART (R71.2 R93.2), SODIMM (J2.31)
RGMII1_RXDV: NET & UART (R76.2 R88.2), SODIMM (J2.29)
RGMII1_TXCLK: NET & UART (R78.2), SODIMM (J2.18)
RGMII1_TXD0: NET & UART (R64.2), SODIMM (J2.20)
RGMII1_TXD1: NET & UART (R65.2), SODIMM (J2.22)
RGMII1_TXD2: NET & UART (R66.2), SODIMM (J2.24)
RGMII1_TXD3: NET & UART (R67.2), SODIMM (J2.26)
RGMII1_TXEN: NET & UART (R75.2), SODIMM (J2.16)
Rscreen_XLeft: LCD (C78.1 J15.1), SODIMM (J1.78)
Rscreen_XRight: LCD (C83.1 J15.2), SODIMM (J1.82)
Rscreen_YDown: LCD (C85.1 J15.4), SODIMM (J1.74)
Rscreen_YUp: LCD (C84.1 J15.3), SODIMM (J1.70)
SPI1_CS0: AD & i2C & SPI (R49.2), LCD (J15.11), SODIMM (J1.59)
SPI1_MISO: AD & i2C & SPI (R84.1), LCD (J15.9), SODIMM (J1.57)
SPI1_MOSI: AD & i2C & SPI (R79.1), LCD (J15.10), SODIMM (J1.55)
SPI1_SCLK: AD & i2C & SPI (R28.2), LCD (J15.12), SODIMM (J1.53)
SYS_WARMRESET: Audio (R96.1 U11.33), NET & UART (R7.2), Power & SD (C80.2 K2.2), SODIMM (J1.91)
UART0_RXD: NET & UART (U10.12), SODIMM (J1.34)
UART0_TXD: NET & UART (U10.11), SODIMM (J1.32)
UART1_RXD: NET & UART (U10.9), SODIMM (J1.46)
UART1_TXD: NET & UART (U10.10), SODIMM (J1.44)
UART2_RX: AD & i2C & SPI (R150.2 U4.2), SODIMM (J1.64)
UART2_TX: AD & i2C & SPI (U4.3), SODIMM (J1.62)
UART4_RX: AD & i2C & SPI (R148.2), SODIMM (J1.26)
UART4_TX: AD & i2C & SPI (R147.1), SODIMM (J1.28)
USB0_DRVVBUS: SODIMM (J2.3), USB (R109.2)
USB0_ID: SODIMM (J2.5), USB (D23.1 J5.4 R13.2 R45.2)
USB0_N: SODIMM (J2.4), USB (D22.1 R48.1)
USB0_P: SODIMM (J2.6), USB (D23.2 R41.1)
USB0_VBUS: SODIMM (J2.1), USB (C15.1 D22.2 J5.1 Q9.2)
USB1_DRVVBUS: SODIMM (J2.11), USB (R110.2)
USB1_ID: SODIMM (J2.9), USB (R36.2)
USB1_N: SODIMM (J2.10), USB (R40.2)
USB1_P: SODIMM (J2.12), USB (R38.2)
USB1_VBUS: SODIMM (J2.13), USB (6 pins)